# EAGLE schematic EL-100-020-001-maincontrlunit (EAGLE 6.6.0)

## Sheet 1 of 9
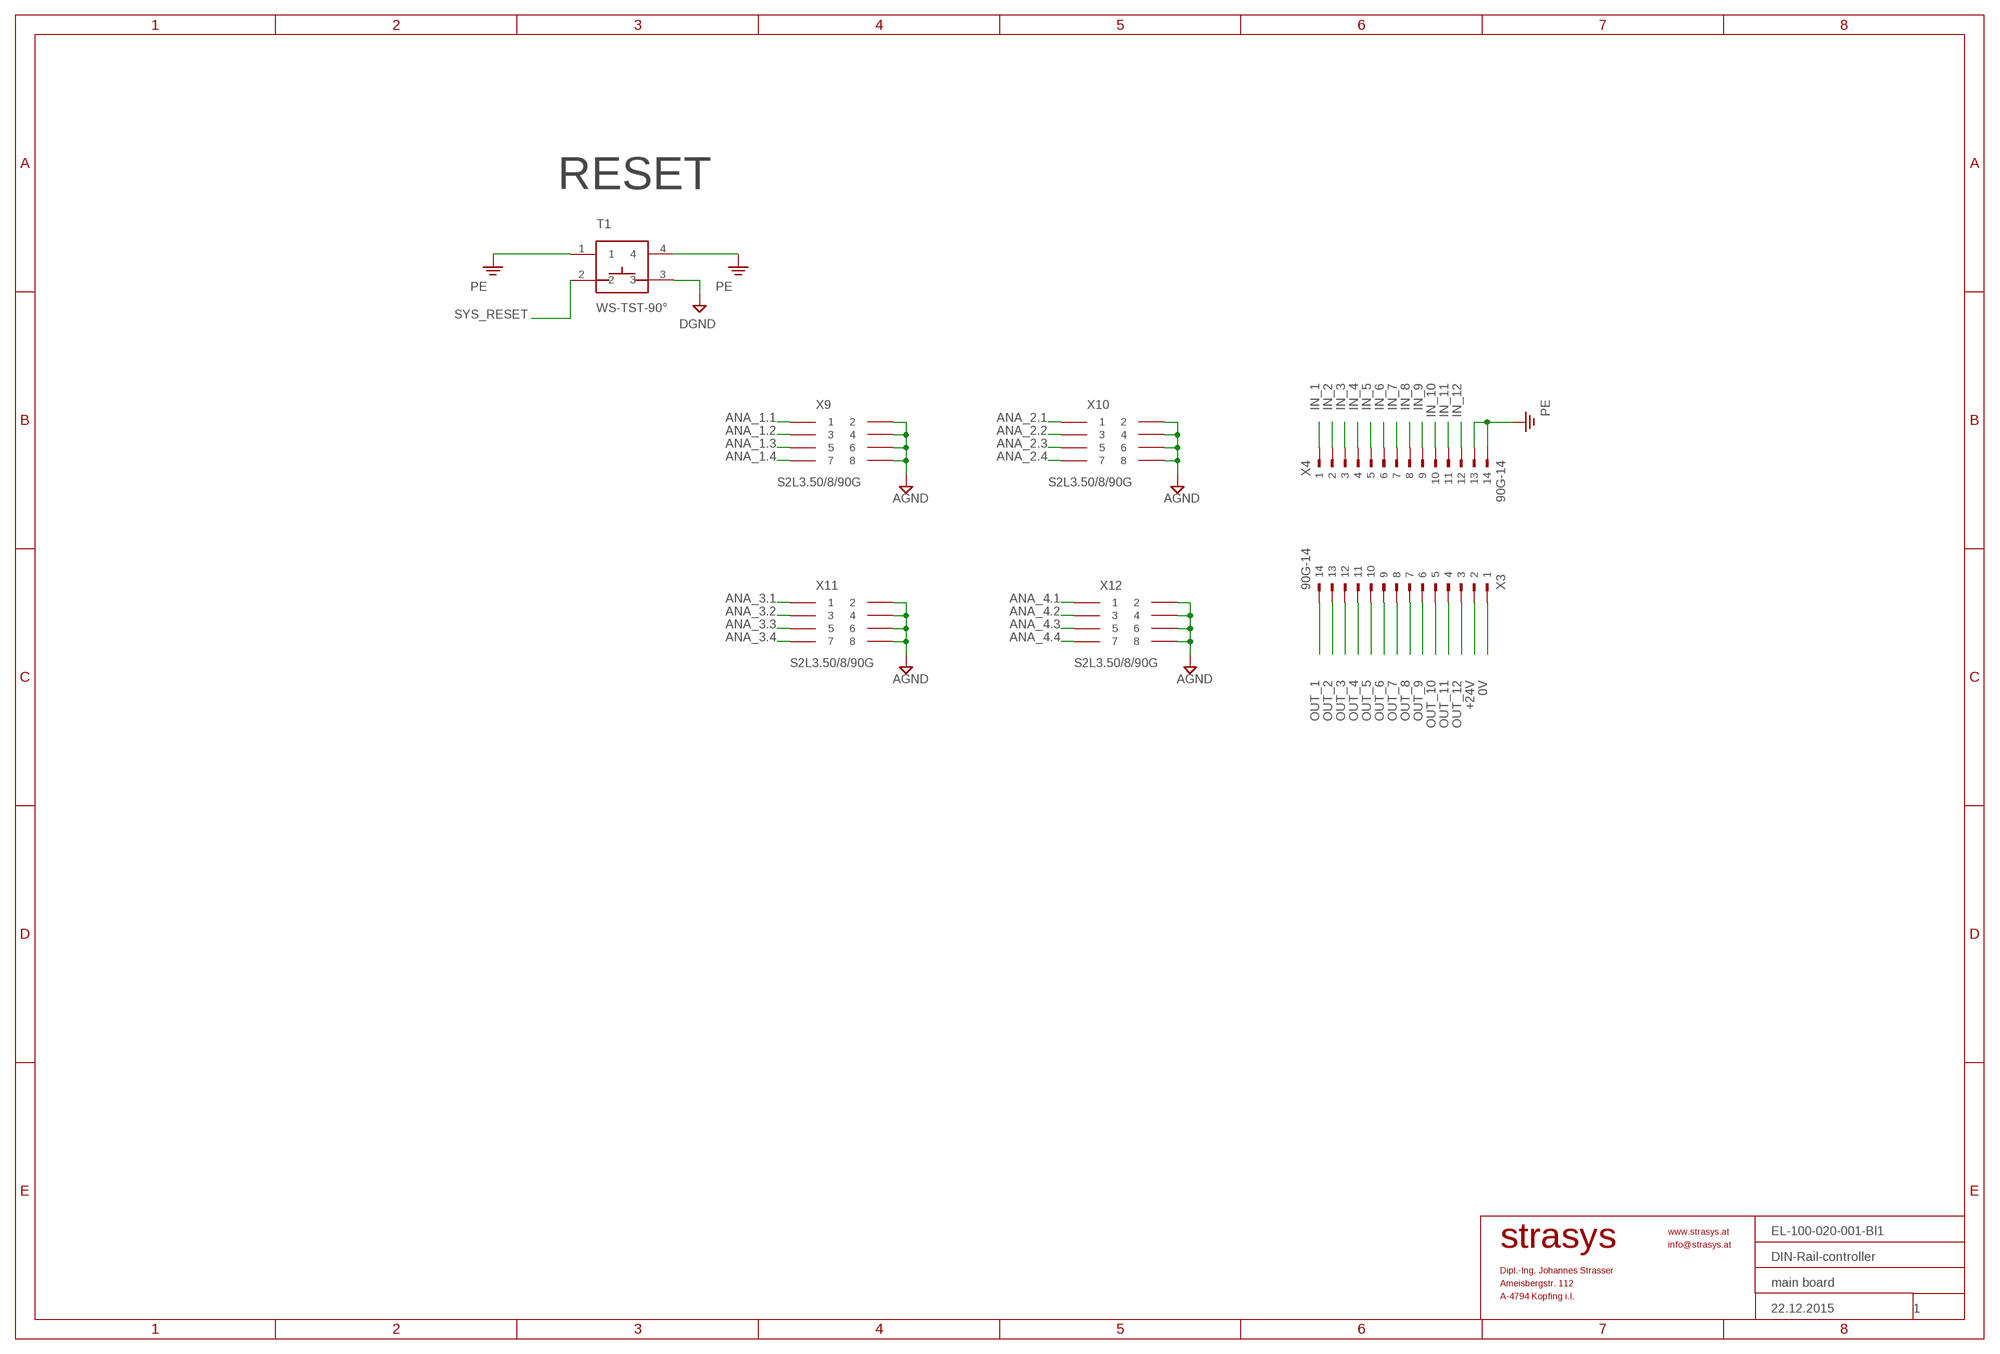
[diagram p0: schematic, sheet 1]
FRAME1 (A3L-LOC): DATE_DRAWING: 22.12.2015; DRAWING_NAME1: DIN-Rail-controller; DRAWING_NAME2: main board; DRAWING_NO: EL-100-020-001-Bl1; PAGE: 1

### Parts
T1  WS-TST-90°  [WS-TST-90°]
X3  90G-14  [90G-14]
X4  90G-14  [90G-14]
X9  S2L3.50/8/90G  [S2L-90G-8]
X10  S2L3.50/8/90G  [S2L-90G-8]
X11  S2L3.50/8/90G  [S2L-90G-8]
X12  S2L3.50/8/90G  [S2L-90G-8]

### Nets
0V: X3.1 ; also sheet 4,5,6,7,9
+24V: X3.2 ; also sheet 4,5,9
AGND: X9.2 X9.4 X9.6 X9.8 X10.2 X10.4 X10.6 X10.8 X11.2 X11.4 X11.6 X11.8 X12.2 X12.4 X12.6 X12.8 ; also sheet 2,8
ANA_1.1: X9.1 ; also sheet 8
ANA_1.2: X9.3 ; also sheet 8
ANA_1.3: X9.5 ; also sheet 8
ANA_1.4: X9.7 ; also sheet 8
ANA_2.1: X10.1 ; also sheet 8
ANA_2.2: X10.3 ; also sheet 8
ANA_2.3: X10.5 ; also sheet 8
ANA_2.4: X10.7 ; also sheet 8
ANA_3.1: X11.1 ; also sheet 8
ANA_3.2: X11.3 ; also sheet 8
ANA_3.3: X11.5 ; also sheet 8
ANA_3.4: X11.7 ; also sheet 8
ANA_4.1: X12.1 ; also sheet 8
ANA_4.2: X12.3 ; also sheet 8
ANA_4.3: X12.5 ; also sheet 8
ANA_4.4: X12.7 ; also sheet 8
DGND: T1.3 ; also sheet 2,3,4,5,6,7,8,9
IN_1: X4.1 ; also sheet 6
IN_2: X4.2 ; also sheet 6
IN_3: X4.3 ; also sheet 6
IN_4: X4.4 ; also sheet 6
IN_5: X4.5 ; also sheet 6
IN_6: X4.6 ; also sheet 6
IN_7: X4.7 ; also sheet 6
IN_8: X4.8 ; also sheet 6
IN_9: X4.9 ; also sheet 7
IN_10: X4.10 ; also sheet 7
IN_11: X4.11 ; also sheet 7
IN_12: X4.12 ; also sheet 7
OUT_1: X3.14 ; also sheet 4
OUT_2: X3.13 ; also sheet 4
OUT_3: X3.12 ; also sheet 4
OUT_4: X3.11 ; also sheet 4
OUT_5: X3.10 ; also sheet 4
OUT_6: X3.9 ; also sheet 4
OUT_7: X3.8 ; also sheet 4
OUT_8: X3.7 ; also sheet 4
OUT_9: X3.6 ; also sheet 5
OUT_10: X3.5 ; also sheet 5
OUT_11: X3.4 ; also sheet 5
OUT_12: X3.3 ; also sheet 5
PE: T1.1 T1.4 X4.13 X4.14 ; also sheet 4,6,7,8
SYS_RESET: T1.2 ; also sheet 2

### Notes on the sheet
- RESET

## Sheet 2 of 9
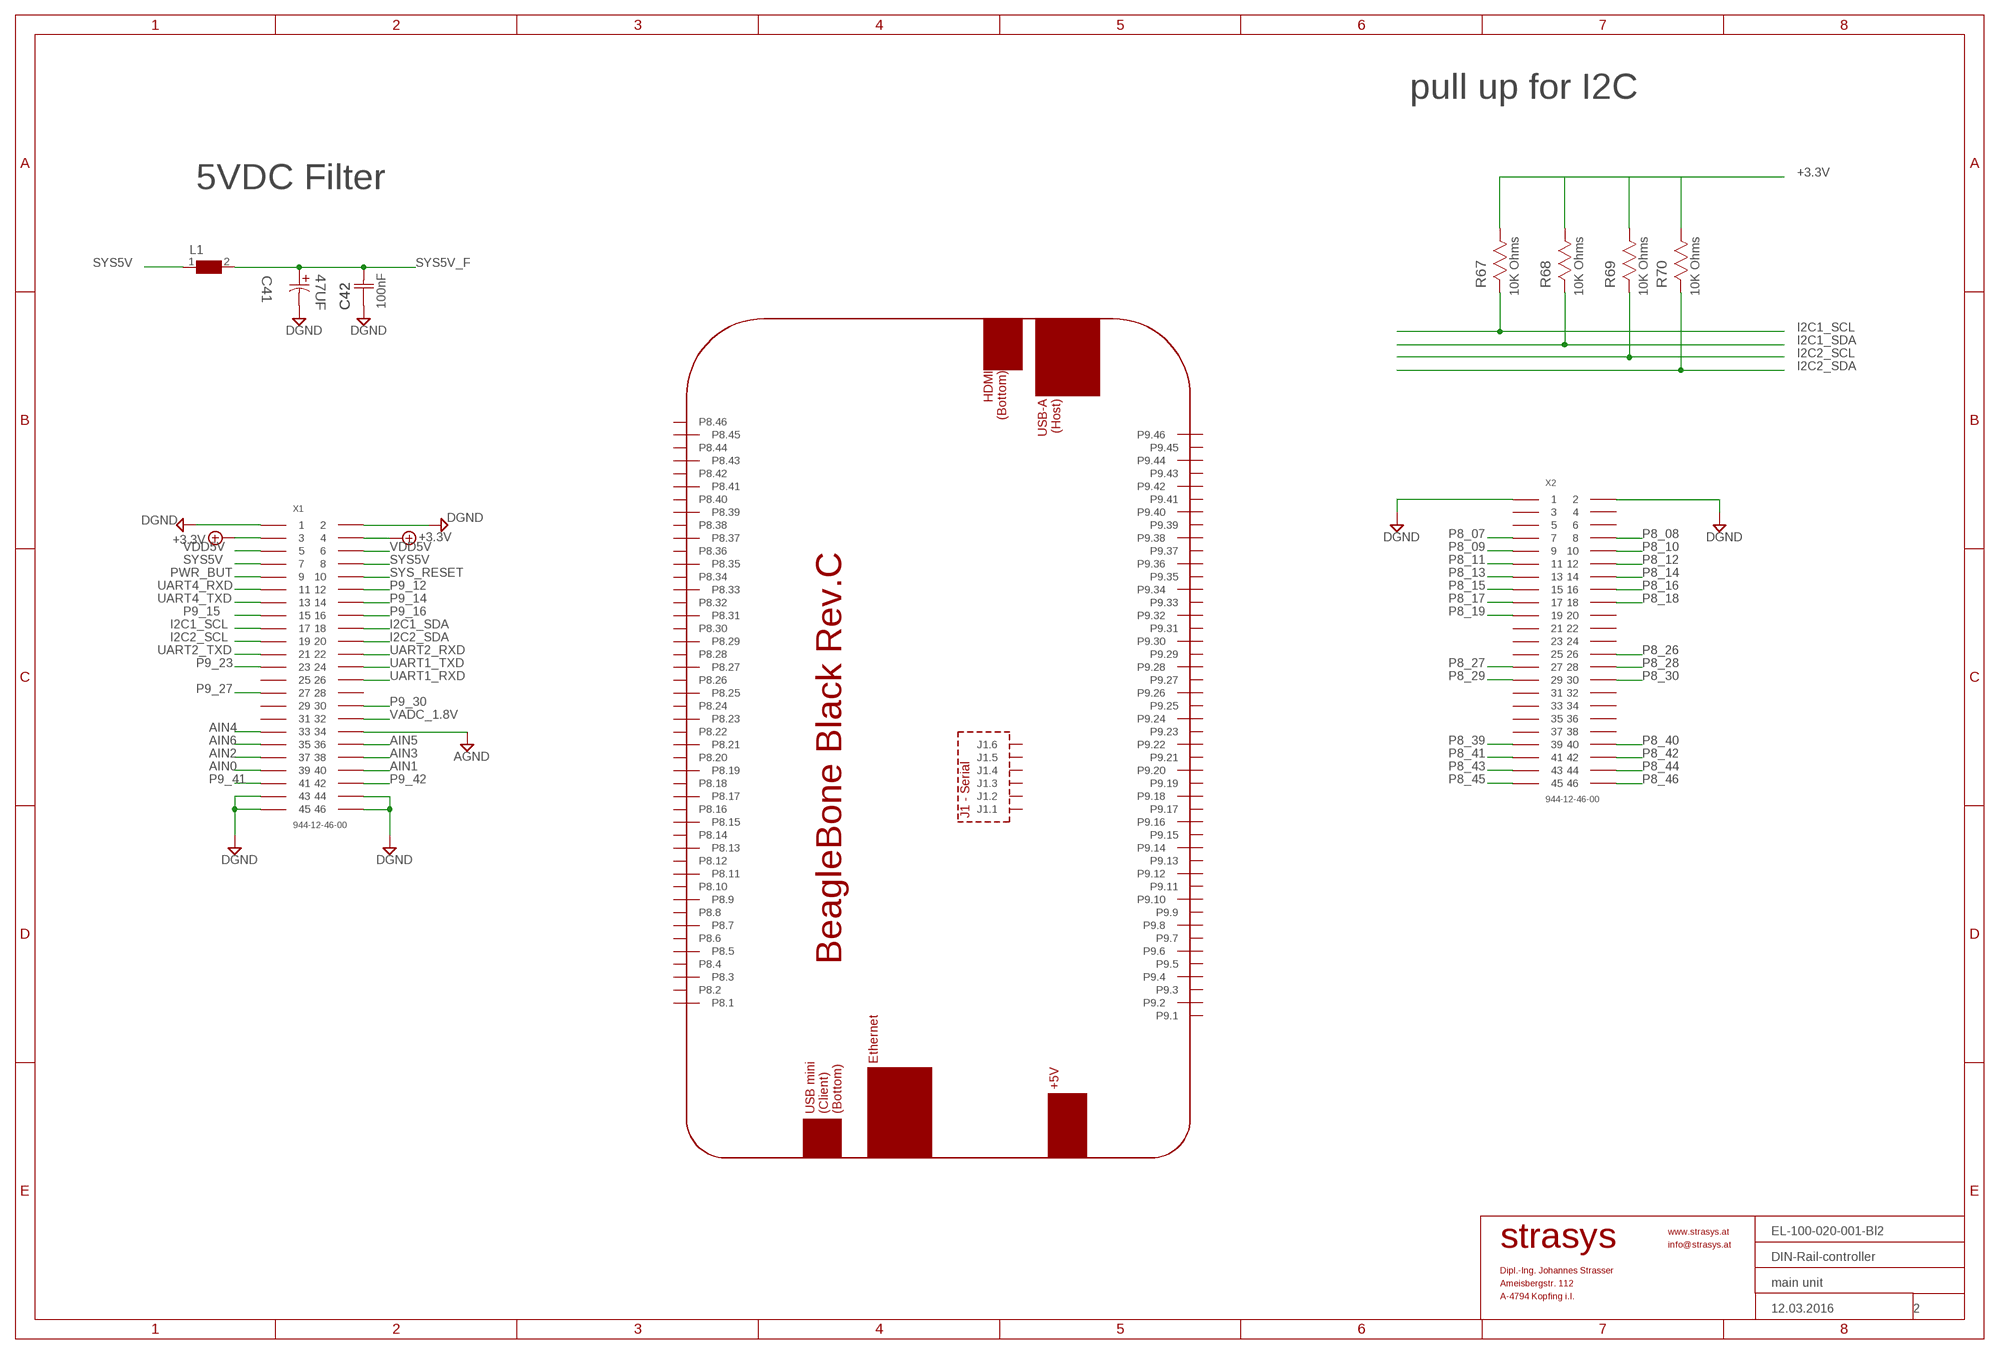
[diagram p1: schematic, sheet 2]
FRAME2 (A3L-LOC): DATE_DRAWING: 12.03.2016; DRAWING_NAME1: DIN-Rail-controller; DRAWING_NAME2: main unit; DRAWING_NO: EL-100-020-001-Bl2; PAGE: 2

### Parts
C41  47UF  EEE-FK1C470P-CASE-D  [CAPAE660X610N]
C42  100nF  C0805C104K5RACTU  [CAPC2013X110N]
L1  WE-CBF-74279218_1206  [1206]
PCB1  BEAGLEBONE_BLACK_EXT  (no package)
R67  10K Ohms  CRCW080510K0JNEA  [RESC2013X65N]
R68  10K Ohms  CRCW080510K0JNEA  [RESC2013X65N]
R69  10K Ohms  CRCW080510K0JNEA  [RESC2013X65N]
R70  10K Ohms  CRCW080510K0JNEA  [RESC2013X65N]
X1  944-12-46-00  [2,54_STIFTLEIST_2X23]
X2  944-12-46-00  [2,54_STIFTLEIST_2X23]

### Nets
+3.3V: R67.1 R68.1 R69.1 R70.1 X1.P3 X1.P4 ; also sheet 3,6,7,8
AGND: X1.P34 ; also sheet 1,8
AIN0: X1.P39 ; also sheet 8
AIN1: X1.P40 ; also sheet 8
AIN2: X1.P37 ; also sheet 8
AIN3: X1.P38 ; also sheet 8
AIN4: X1.P33 ; also sheet 8
AIN5: X1.P36 ; also sheet 8
AIN6: X1.P35 ; also sheet 8
DGND: C41.2 C42.1(C1) X1.P1 X1.P2 X1.P43 X1.P44 X1.P45 X1.P46 X2.P1 X2.P2 ; also sheet 1,3,4,5,6,7,8,9
I2C1_SCL: R67.2 X1.P17 ; also sheet 3,8
I2C1_SDA: R68.2 X1.P18 ; also sheet 3,8
I2C2_SCL: R69.2 X1.P19 ; also sheet 3,8
I2C2_SDA: R70.2 X1.P20 ; also sheet 3,8
P8_07: X2.P7 ; also sheet 4
P8_08: X2.P8 ; also sheet 4
P8_09: X2.P9 ; also sheet 4
P8_10: X2.P10 ; also sheet 4
P8_11: X2.P11 ; also sheet 4
P8_12: X2.P12 ; also sheet 4
P8_13: X2.P13 ; also sheet 4
P8_14: X2.P14 ; also sheet 4
P8_15: X2.P15 ; also sheet 6
P8_16: X2.P16 ; also sheet 6
P8_17: X2.P17 ; also sheet 6
P8_18: X2.P18 ; also sheet 6
P8_19: X2.P19
P8_26: X2.P26
P8_27: X2.P27 ; also sheet 5
P8_28: X2.P28 ; also sheet 5
P8_29: X2.P29 ; also sheet 5
P8_30: X2.P30 ; also sheet 5
P8_39: X2.P39 ; also sheet 6
P8_40: X2.P40 ; also sheet 6
P8_41: X2.P41 ; also sheet 6
P8_42: X2.P42 ; also sheet 6
P8_43: X2.P43 ; also sheet 7
P8_44: X2.P44 ; also sheet 7
P8_45: X2.P45 ; also sheet 7
P8_46: X2.P46 ; also sheet 7
P9_12: X1.P12
P9_14: X1.P14 ; also sheet 9
P9_15: X1.P15 ; also sheet 9
P9_16: X1.P16
P9_23: X1.P23
P9_27: X1.P27
P9_30: X1.P30
P9_41: X1.P41
P9_42: X1.P42
PWR_BUT: X1.P9
SYS5V: L1.1 X1.P7 X1.P8
SYS5V_F: C41.1 C42.2(C2) L1.2 ; also sheet 8,9
SYS_RESET: X1.P10 ; also sheet 1
UART1_RXD: X1.P26
UART1_TXD: X1.P24
UART2_RXD: X1.P22
UART2_TXD: X1.P21
UART4_RXD: X1.P11
UART4_TXD: X1.P13
VADC_1.8V: X1.P32
VDD5V: X1.P5 X1.P6
Unconnected: PCB1.J1.1 PCB1.J1.2 PCB1.J1.3 PCB1.J1.4 PCB1.J1.5 PCB1.J1.6 PCB1.P8.1 PCB1.P8.2 PCB1.P8.3 PCB1.P8.4 PCB1.P8.5 PCB1.P8.6 PCB1.P8.7 PCB1.P8.8 PCB1.P8.9 PCB1.P8.10 PCB1.P8.11 PCB1.P8.12 PCB1.P8.13 PCB1.P8.14 PCB1.P8.15 PCB1.P8.16 PCB1.P8.17 PCB1.P8.18 PCB1.P8.19 PCB1.P8.20 PCB1.P8.21 PCB1.P8.22 PCB1.P8.23 PCB1.P8.24 PCB1.P8.25 PCB1.P8.26 PCB1.P8.27 PCB1.P8.28 PCB1.P8.29 PCB1.P8.30 PCB1.P8.31 PCB1.P8.32 PCB1.P8.33 PCB1.P8.34 PCB1.P8.35 PCB1.P8.36 PCB1.P8.37 PCB1.P8.38 PCB1.P8.39 PCB1.P8.40 PCB1.P8.41 PCB1.P8.42 PCB1.P8.43 PCB1.P8.44 PCB1.P8.45 PCB1.P8.46 PCB1.P9.1 PCB1.P9.2 PCB1.P9.3 PCB1.P9.4 PCB1.P9.5 PCB1.P9.6 PCB1.P9.7 PCB1.P9.8 PCB1.P9.9 PCB1.P9.10 PCB1.P9.11 PCB1.P9.12 PCB1.P9.13 PCB1.P9.14 PCB1.P9.15 PCB1.P9.16 PCB1.P9.17 PCB1.P9.18 PCB1.P9.19 PCB1.P9.20 PCB1.P9.21 PCB1.P9.22 PCB1.P9.23 PCB1.P9.24 PCB1.P9.25 PCB1.P9.26 PCB1.P9.27 PCB1.P9.28 PCB1.P9.29 PCB1.P9.30 PCB1.P9.31 PCB1.P9.32 PCB1.P9.33 PCB1.P9.34 PCB1.P9.35 PCB1.P9.36 PCB1.P9.37 PCB1.P9.38 PCB1.P9.39 PCB1.P9.40 PCB1.P9.41 PCB1.P9.42 PCB1.P9.43 PCB1.P9.44 PCB1.P9.45 PCB1.P9.46 X1.P25 X1.P28 X1.P29 X1.P31 X2.P3 X2.P4 X2.P5 X2.P6 X2.P20 X2.P21 X2.P22 X2.P23 X2.P24 X2.P25 X2.P31 X2.P32 X2.P33 X2.P34 X2.P35 X2.P36 X2.P37 X2.P38

### Notes on the sheet
- pull up for I2C
- 5VDC Filter

## Sheet 3 of 9
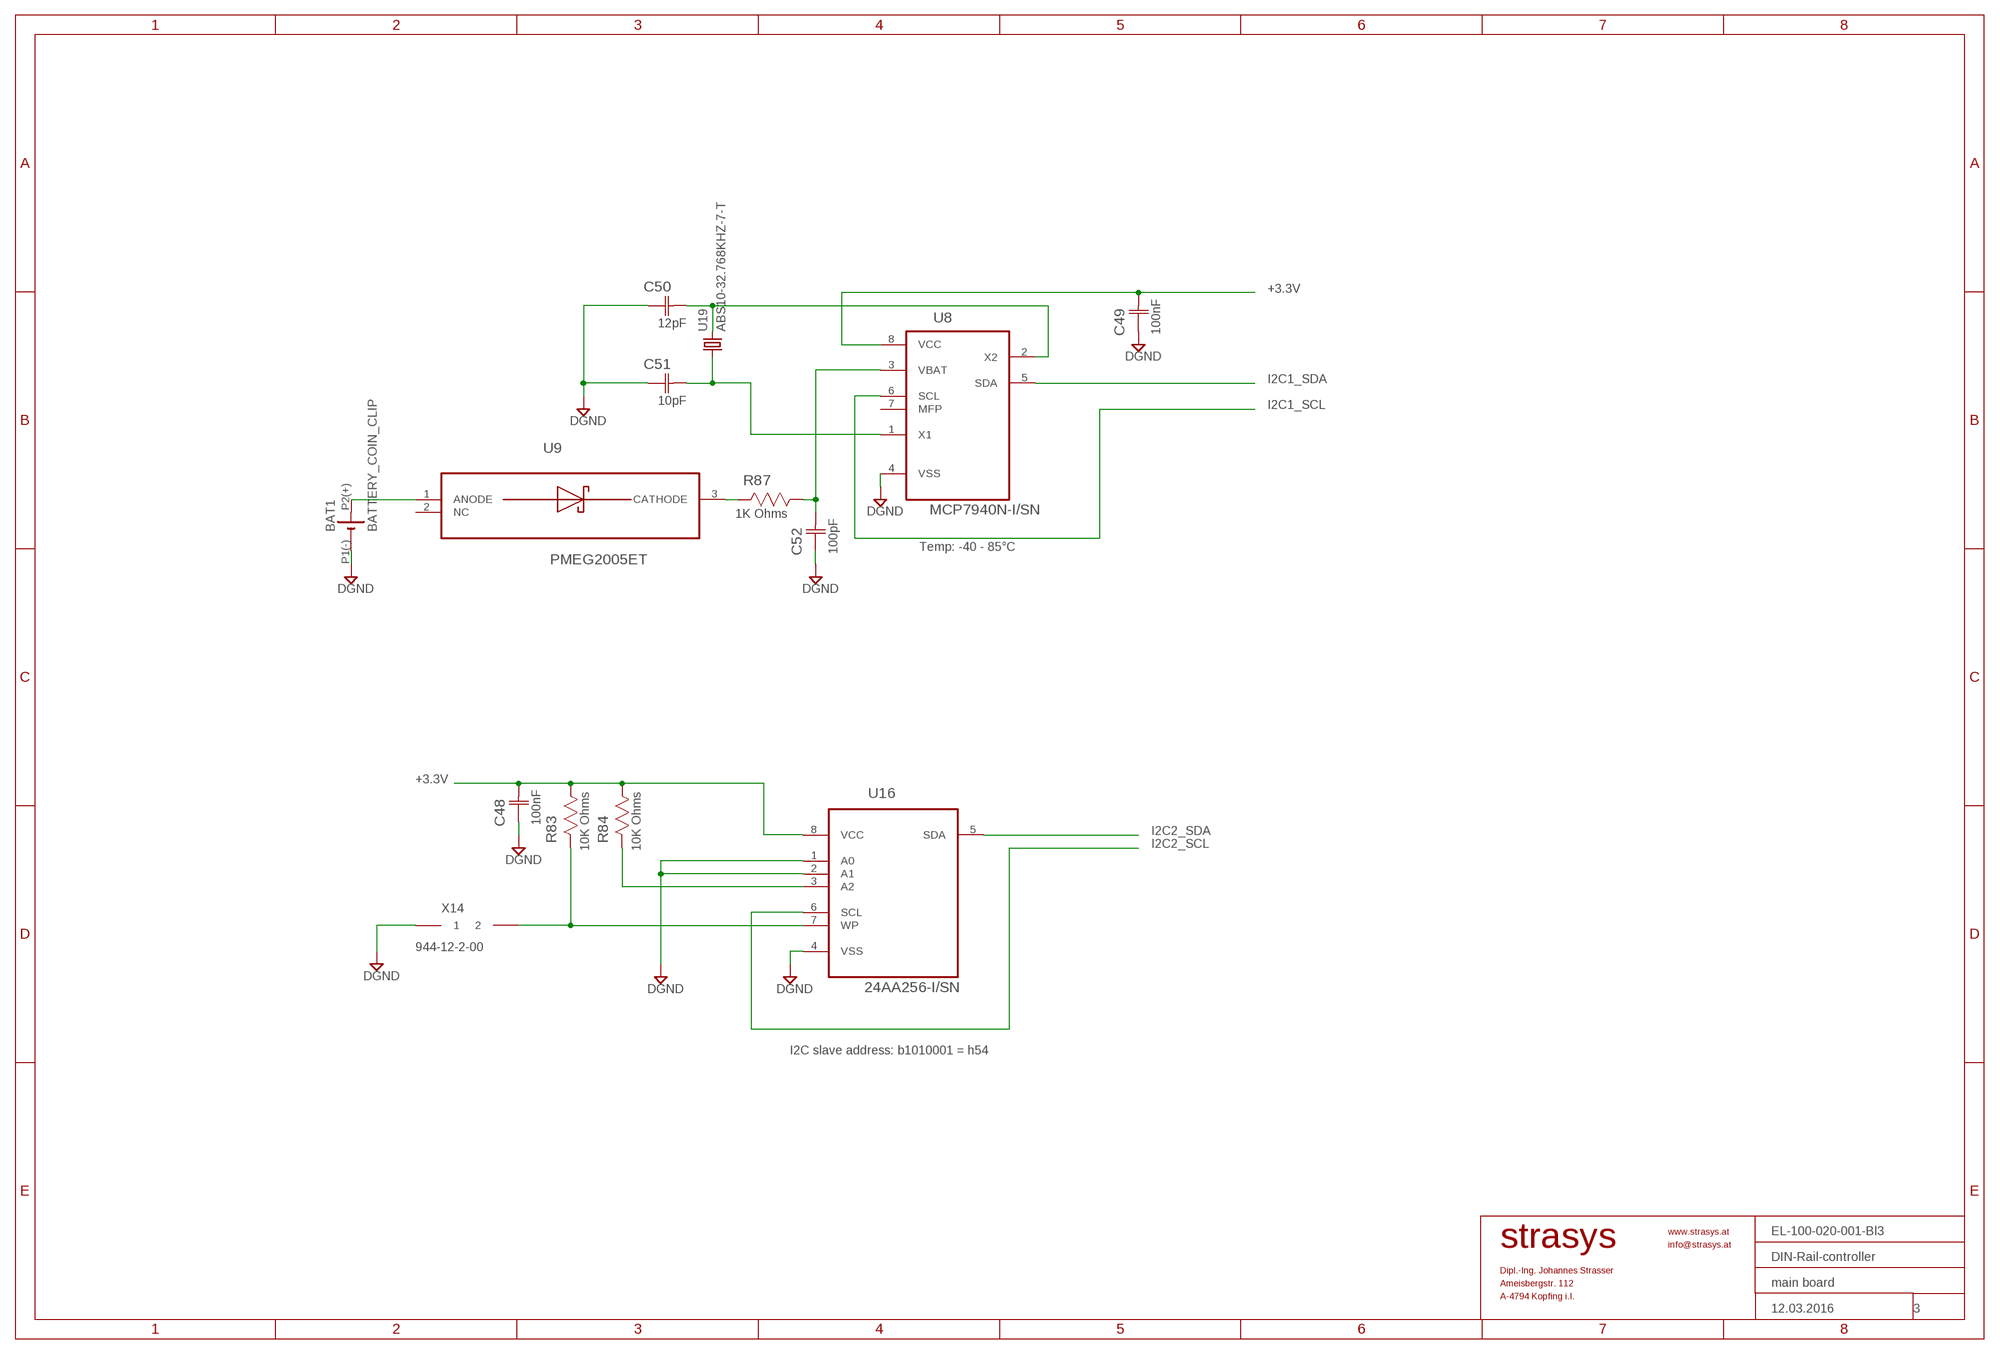
[diagram p2: schematic, sheet 3]
FRAME3 (A3L-LOC): DATE_DRAWING: 12.03.2016; DRAWING_NAME1: DIN-Rail-controller; DRAWING_NAME2: main board; DRAWING_NO: EL-100-020-001-Bl3; PAGE: 3

### Parts
BAT1  BATTERY_COIN_CLIP  [BAT_HOLDER_16MM]
C48  100nF  C0805C104K5RACTU  [CAPC2013X110N]
C49  100nF  C0805C104K5RACTU  [CAPC2013X110N]
C50  12pF  C0805C120J5GACTU  [CAPC2013X88N]
C51  10pF  C0805C100J5GACTU  [CAPC2013X88N]
C52  100pF  C0805C101J5GACTU  [CAPC2013X88N]
R83  10K Ohms  CRCW080510K0JNEA  [RESC2013X65N]
R84  10K Ohms  CRCW080510K0JNEA  [RESC2013X65N]
R87  1K Ohms  CRCW08051K00FKEA  [RESC2013X65N]
U8  MCP7940N-I/SN  [SOIC127P600X175-8N]
U9  PMEG2005ET  [SOT95P280X145-5N]
U16  24AA256-I/SN  [SOIC127P600X175-8N]
U19  ABS10-32.768KHZ-7-T  [ABS-10]
X14  944-12-2-00  [2,54_2X1]

### Nets
24AA_WP: R83.2 U16.7(WP) X14.P2
+3.3V: C48.2(C2) C49.2(C2) R83.1 R84.1 U8.8(VCC) U16.8(VCC) ; also sheet 2,6,7,8
BAT-SUPPLY: BAT1.P2(+)(+) U9.1(ANODE)
DGND: BAT1.P1(-)(-) C48.1(C1) C49.1(C1) C50.1(C1) C51.1(C1) C52.1(C1) U8.4(VSS) U16.1(A0) U16.2(A1) U16.4(VSS) X14.P1 ; also sheet 1,2,4,5,6,7,8,9
I2C1_SCL: U8.6(SCL) ; also sheet 2,8
I2C1_SDA: U8.5(SDA) ; also sheet 2,8
I2C2_SCL: U16.6(SCL) ; also sheet 2,8
I2C2_SDA: U16.5(SDA) ; also sheet 2,8
N$5: R84.2 U16.3(A2)
N$46: R87.2 U9.3(CATHODE)
N$47: C52.2(C2) R87.1 U8.3(VBAT)
N$48: C50.2(C2) U8.2(X2) U19.P$2
N$51: C51.2(C2) U8.1(X1) U19.P$1
Unconnected: U8.7(MFP) U9.2(NC)

### Notes on the sheet
- Temp: -40 - 85°C
- I2C slave address: b1010001 = h54

## Sheet 4 of 9
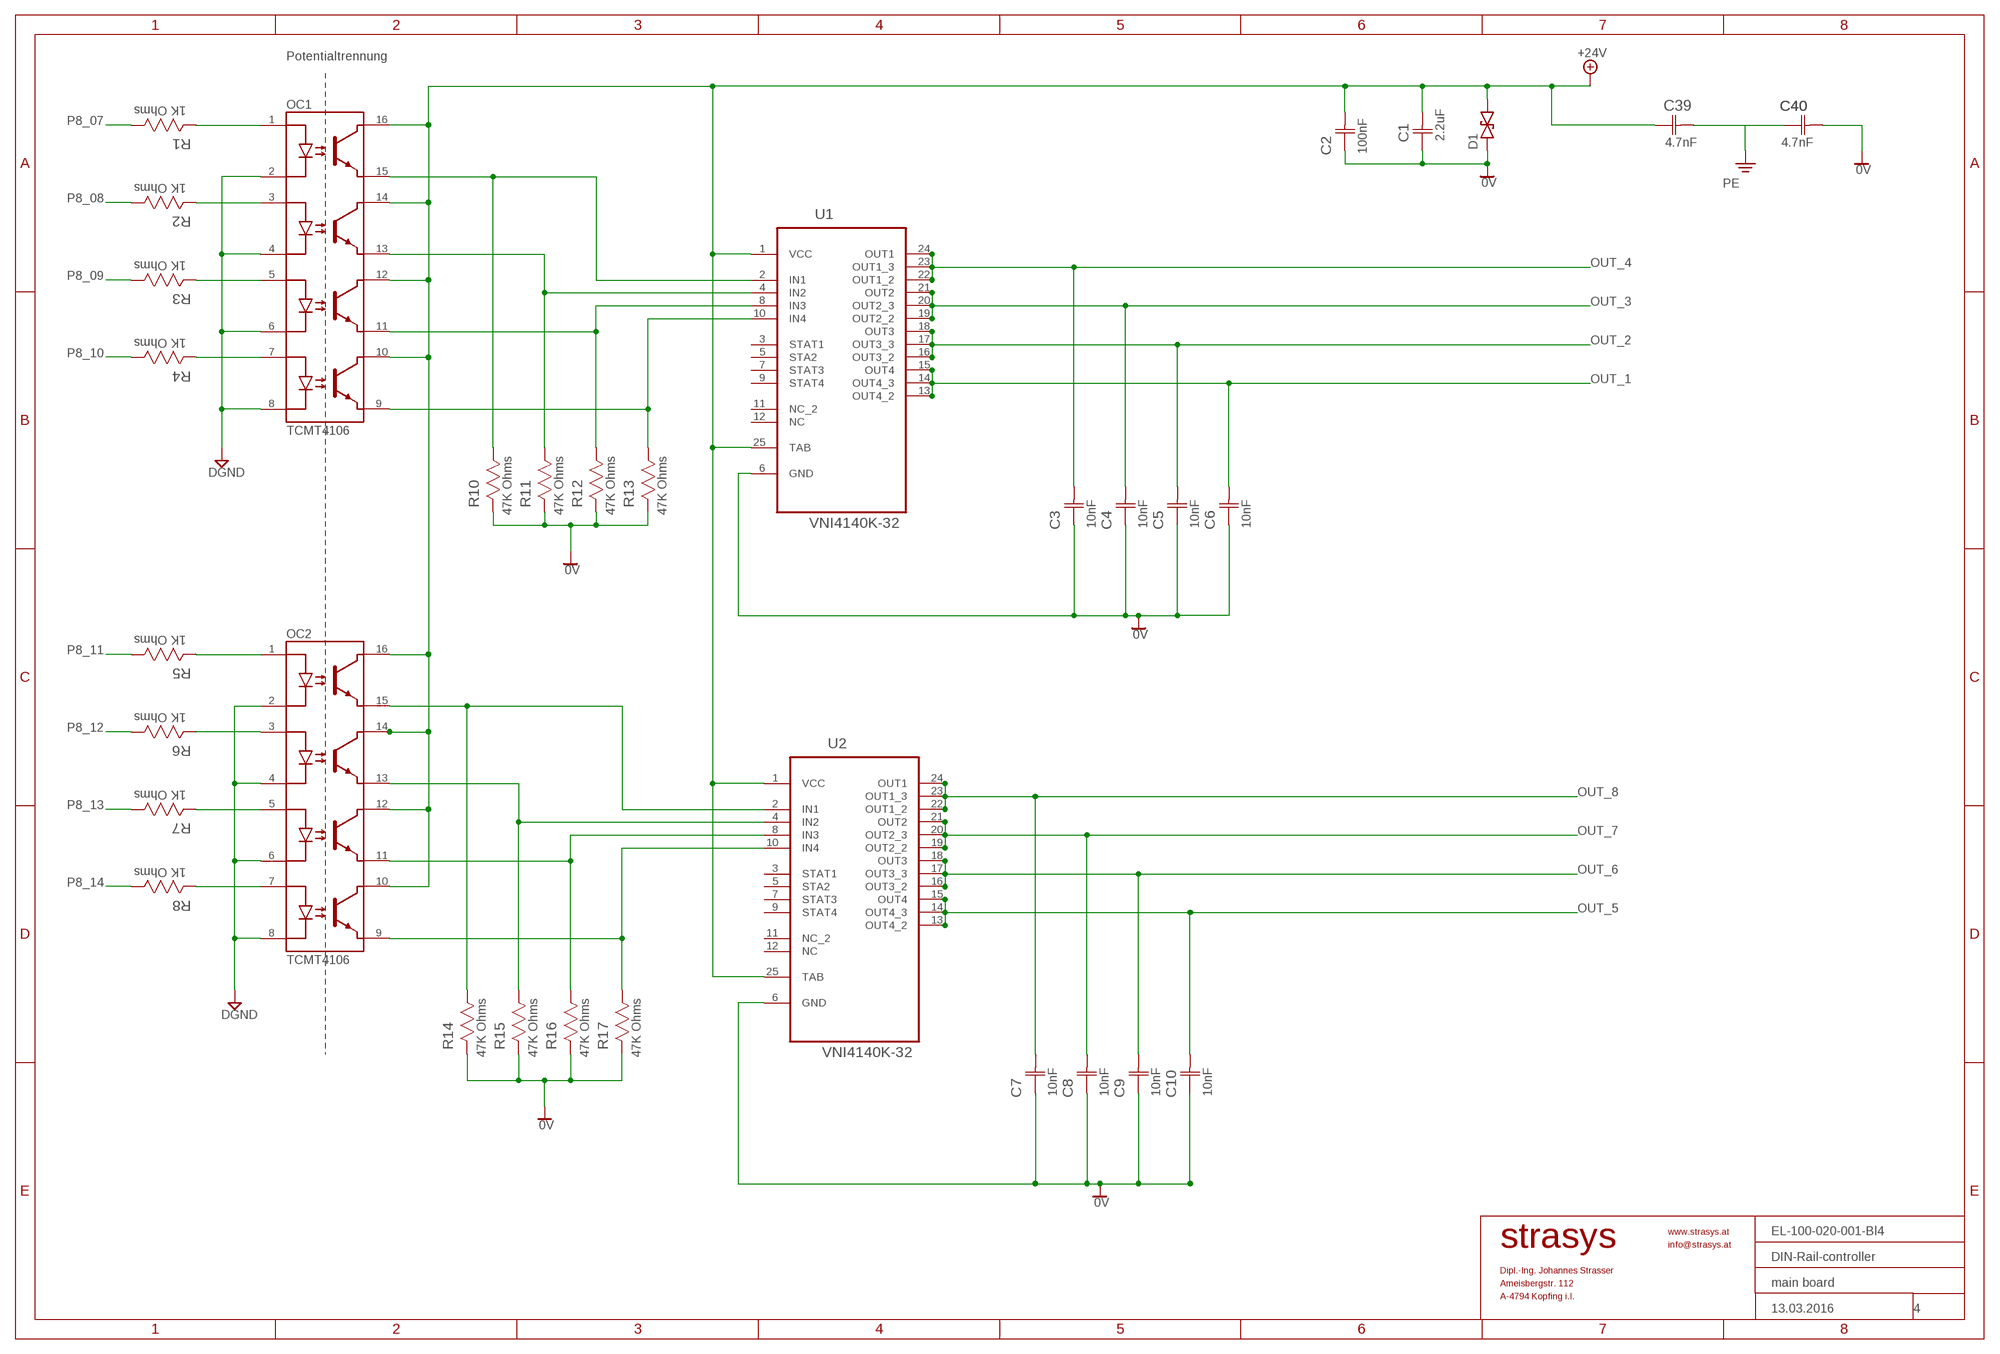
[diagram p3: schematic, sheet 4]
FRAME4 (A3L-LOC): DATE_DRAWING: 13.03.2016; DRAWING_NAME1: DIN-Rail-controller; DRAWING_NAME2: main board; DRAWING_NO: EL-100-020-001-Bl4; PAGE: 4

### Parts
C1  2.2uF  C1206C225K5RACTU  [CAPC3216X180N]
C2  100nF  C0805C104K5RACTU  [CAPC2013X110N]
C3  10nF  C0805C103K1RACTU  [CAPC2013X88N]
C4  10nF  C0805C103K1RACTU  [CAPC2013X88N]
C5  10nF  C0805C103K1RACTU  [CAPC2013X88N]
C6  10nF  C0805C103K1RACTU  [CAPC2013X88N]
C7  10nF  C0805C103K1RACTU  [CAPC2013X88N]
C8  10nF  C0805C103K1RACTU  [CAPC2013X88N]
C9  10nF  C0805C103K1RACTU  [CAPC2013X88N]
C10  10nF  C0805C103K1RACTU  [CAPC2013X88N]
C39  4.7nF  C0805F472K1RACAUTO  [CAPC2013X88N]
C40  4.7nF  C0805F472K1RACAUTO  [CAPC2013X88N]
D1  SMA6J33CA  [DO-214AC]
OC1  TCMT4106  [SOP-16]
OC2  TCMT4106  [SOP-16]
R1  1K Ohms  CRCW08051K00JNEA  [RESC2013X65N]
R2  1K Ohms  CRCW08051K00JNEA  [RESC2013X65N]
R3  1K Ohms  CRCW08051K00JNEA  [RESC2013X65N]
R4  1K Ohms  CRCW08051K00JNEA  [RESC2013X65N]
R5  1K Ohms  CRCW08051K00JNEA  [RESC2013X65N]
R6  1K Ohms  CRCW08051K00JNEA  [RESC2013X65N]
R7  1K Ohms  CRCW08051K00JNEA  [RESC2013X65N]
R8  1K Ohms  CRCW08051K00JNEA  [RESC2013X65N]
R10  47K Ohms  CRCW080547K0JNEA  [RESC2013X65N]
R11  47K Ohms  CRCW080547K0JNEA  [RESC2013X65N]
R12  47K Ohms  CRCW080547K0JNEA  [RESC2013X65N]
R13  47K Ohms  CRCW080547K0JNEA  [RESC2013X65N]
R14  47K Ohms  CRCW080547K0JNEA  [RESC2013X65N]
R15  47K Ohms  CRCW080547K0JNEA  [RESC2013X65N]
R16  47K Ohms  CRCW080547K0JNEA  [RESC2013X65N]
R17  47K Ohms  CRCW080547K0JNEA  [RESC2013X65N]
U1  VNI4140K-32  [SOP80P1030X247-25N]
U2  VNI4140K-32  [SOP80P1030X247-25N]

### Nets
0V: C1.1(C1) C2.1(C1) C3.1(C1) C4.1(C1) C5.1(C1) C6.1(C1) C7.1(C1) C8.1(C1) C9.1(C1) C10.1(C1) C40.2(C2) D1.1 R10.2 R11.2 R12.2 R13.2 R14.2 R15.2 R16.2 R17.2 U1.6(GND) U2.6(GND) ; also sheet 1,5,6,7,9
+24V: C1.2(C2) C2.2(C2) C39.1(C1) D1.2 OC1.10 OC1.12 OC1.14 OC1.16 OC2.10 OC2.12 OC2.14 OC2.16 U1.1(VCC) U1.25(TAB) U2.1(VCC) U2.25(TAB) ; also sheet 1,5,9
DGND: OC1.2 OC1.4 OC1.6 OC1.8 OC2.2 OC2.4 OC2.6 OC2.8 ; also sheet 1,2,3,5,6,7,8,9
N$6: OC1.5 R3.2
N$7: OC1.7 R4.2
N$8: OC2.3 R6.2
N$9: OC2.5 R7.2
N$10: OC2.7 R8.2
N$14: OC1.1 R1.2
N$15: OC1.3 R2.2
N$19: OC1.15 R10.1 U1.2(IN1)
N$20: OC1.13 R11.1 U1.4(IN2)
N$21: OC1.11 R12.1 U1.8(IN3)
N$22: OC1.9 R13.1 U1.10(IN4)
N$23: OC2.1 R5.2
N$27: OC2.15 R14.1 U2.2(IN1)
N$28: OC2.13 R15.1 U2.4(IN2)
N$29: OC2.11 R16.1 U2.8(IN3)
N$30: OC2.9 R17.1 U2.10(IN4)
OUT_1: C6.2(C2) U1.13(OUT4_2) U1.14(OUT4_3) U1.15(OUT4) ; also sheet 1
OUT_2: C5.2(C2) U1.16(OUT3_2) U1.17(OUT3_3) U1.18(OUT3) ; also sheet 1
OUT_3: C4.2(C2) U1.19(OUT2_2) U1.20(OUT2_3) U1.21(OUT2) ; also sheet 1
OUT_4: C3.2(C2) U1.22(OUT1_2) U1.23(OUT1_3) U1.24(OUT1) ; also sheet 1
OUT_5: C10.2(C2) U2.13(OUT4_2) U2.14(OUT4_3) U2.15(OUT4) ; also sheet 1
OUT_6: C9.2(C2) U2.16(OUT3_2) U2.17(OUT3_3) U2.18(OUT3) ; also sheet 1
OUT_7: C8.2(C2) U2.19(OUT2_2) U2.20(OUT2_3) U2.21(OUT2) ; also sheet 1
OUT_8: C7.2(C2) U2.22(OUT1_2) U2.23(OUT1_3) U2.24(OUT1) ; also sheet 1
P8_07: R1.1 ; also sheet 2
P8_08: R2.1 ; also sheet 2
P8_09: R3.1 ; also sheet 2
P8_10: R4.1 ; also sheet 2
P8_11: R5.1 ; also sheet 2
P8_12: R6.1 ; also sheet 2
P8_13: R7.1 ; also sheet 2
P8_14: R8.1 ; also sheet 2
PE: C39.2(C2) C40.1(C1) ; also sheet 1,6,7,8
Unconnected: U1.3(STAT1) U1.5(STA2) U1.7(STAT3) U1.9(STAT4) U1.11(NC_2) U1.12(NC) U2.3(STAT1) U2.5(STA2) U2.7(STAT3) U2.9(STAT4) U2.11(NC_2) U2.12(NC)

### Notes on the sheet
- Potentialtrennung

## Sheet 5 of 9
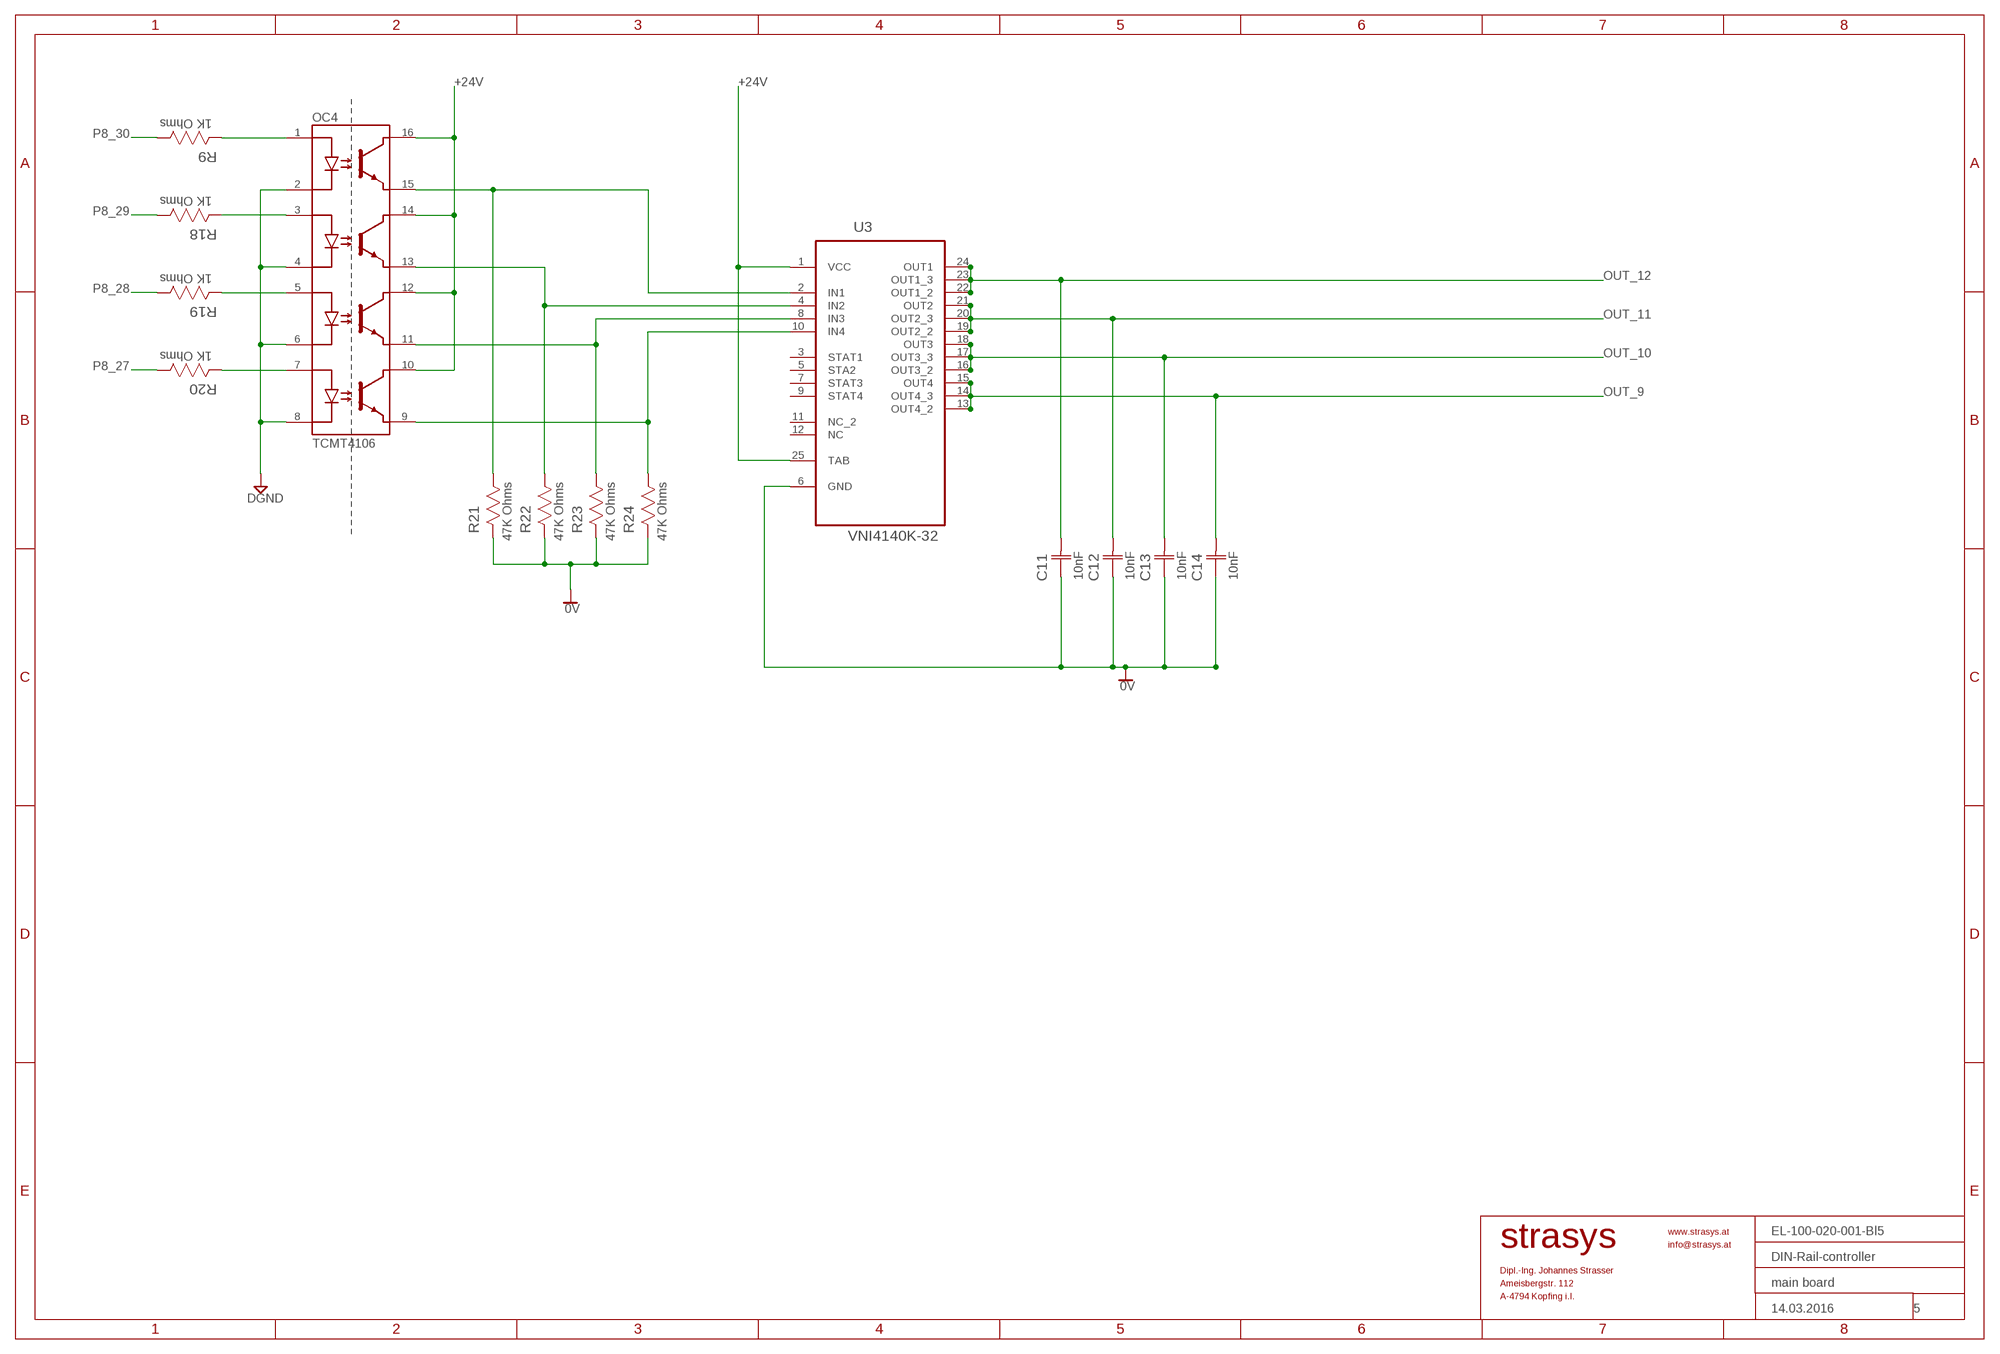
[diagram p4: schematic, sheet 5]
FRAME5 (A3L-LOC): DATE_DRAWING: 14.03.2016; DRAWING_NAME1: DIN-Rail-controller; DRAWING_NAME2: main board; DRAWING_NO: EL-100-020-001-Bl5; PAGE: 5

### Parts
C11  10nF  C0805C103K1RACTU  [CAPC2013X88N]
C12  10nF  C0805C103K1RACTU  [CAPC2013X88N]
C13  10nF  C0805C103K1RACTU  [CAPC2013X88N]
C14  10nF  C0805C103K1RACTU  [CAPC2013X88N]
OC4  TCMT4106  [SOP-16]
R9  1K Ohms  CRCW08051K00JNEA  [RESC2013X65N]
R18  1K Ohms  CRCW08051K00JNEA  [RESC2013X65N]
R19  1K Ohms  CRCW08051K00JNEA  [RESC2013X65N]
R20  1K Ohms  CRCW08051K00JNEA  [RESC2013X65N]
R21  47K Ohms  CRCW080547K0JNEA  [RESC2013X65N]
R22  47K Ohms  CRCW080547K0JNEA  [RESC2013X65N]
R23  47K Ohms  CRCW080547K0JNEA  [RESC2013X65N]
R24  47K Ohms  CRCW080547K0JNEA  [RESC2013X65N]
U3  VNI4140K-32  [SOP80P1030X247-25N]

### Nets
0V: C11.1(C1) C12.1(C1) C13.1(C1) C14.1(C1) R21.2 R22.2 R23.2 R24.2 U3.6(GND) ; also sheet 1,4,6,7,9
+24V: OC4.10 OC4.12 OC4.14 OC4.16 U3.1(VCC) U3.25(TAB) ; also sheet 1,4,9
DGND: OC4.2 OC4.4 OC4.6 OC4.8 ; also sheet 1,2,3,4,6,7,8,9
N$11: OC4.1 R9.2
N$12: OC4.15 R21.1 U3.2(IN1)
N$13: OC4.13 R22.1 U3.4(IN2)
N$16: OC4.11 R23.1 U3.8(IN3)
N$17: OC4.9 R24.1 U3.10(IN4)
N$18: OC4.3 R18.2
N$24: OC4.5 R19.2
N$25: OC4.7 R20.2
OUT_9: C14.2(C2) U3.13(OUT4_2) U3.14(OUT4_3) U3.15(OUT4) ; also sheet 1
OUT_10: C13.2(C2) U3.16(OUT3_2) U3.17(OUT3_3) U3.18(OUT3) ; also sheet 1
OUT_11: C12.2(C2) U3.19(OUT2_2) U3.20(OUT2_3) U3.21(OUT2) ; also sheet 1
OUT_12: C11.2(C2) U3.22(OUT1_2) U3.23(OUT1_3) U3.24(OUT1) ; also sheet 1
P8_27: R20.1 ; also sheet 2
P8_28: R19.1 ; also sheet 2
P8_29: R18.1 ; also sheet 2
P8_30: R9.1 ; also sheet 2
Unconnected: U3.3(STAT1) U3.5(STA2) U3.7(STAT3) U3.9(STAT4) U3.11(NC_2) U3.12(NC)

## Sheet 6 of 9
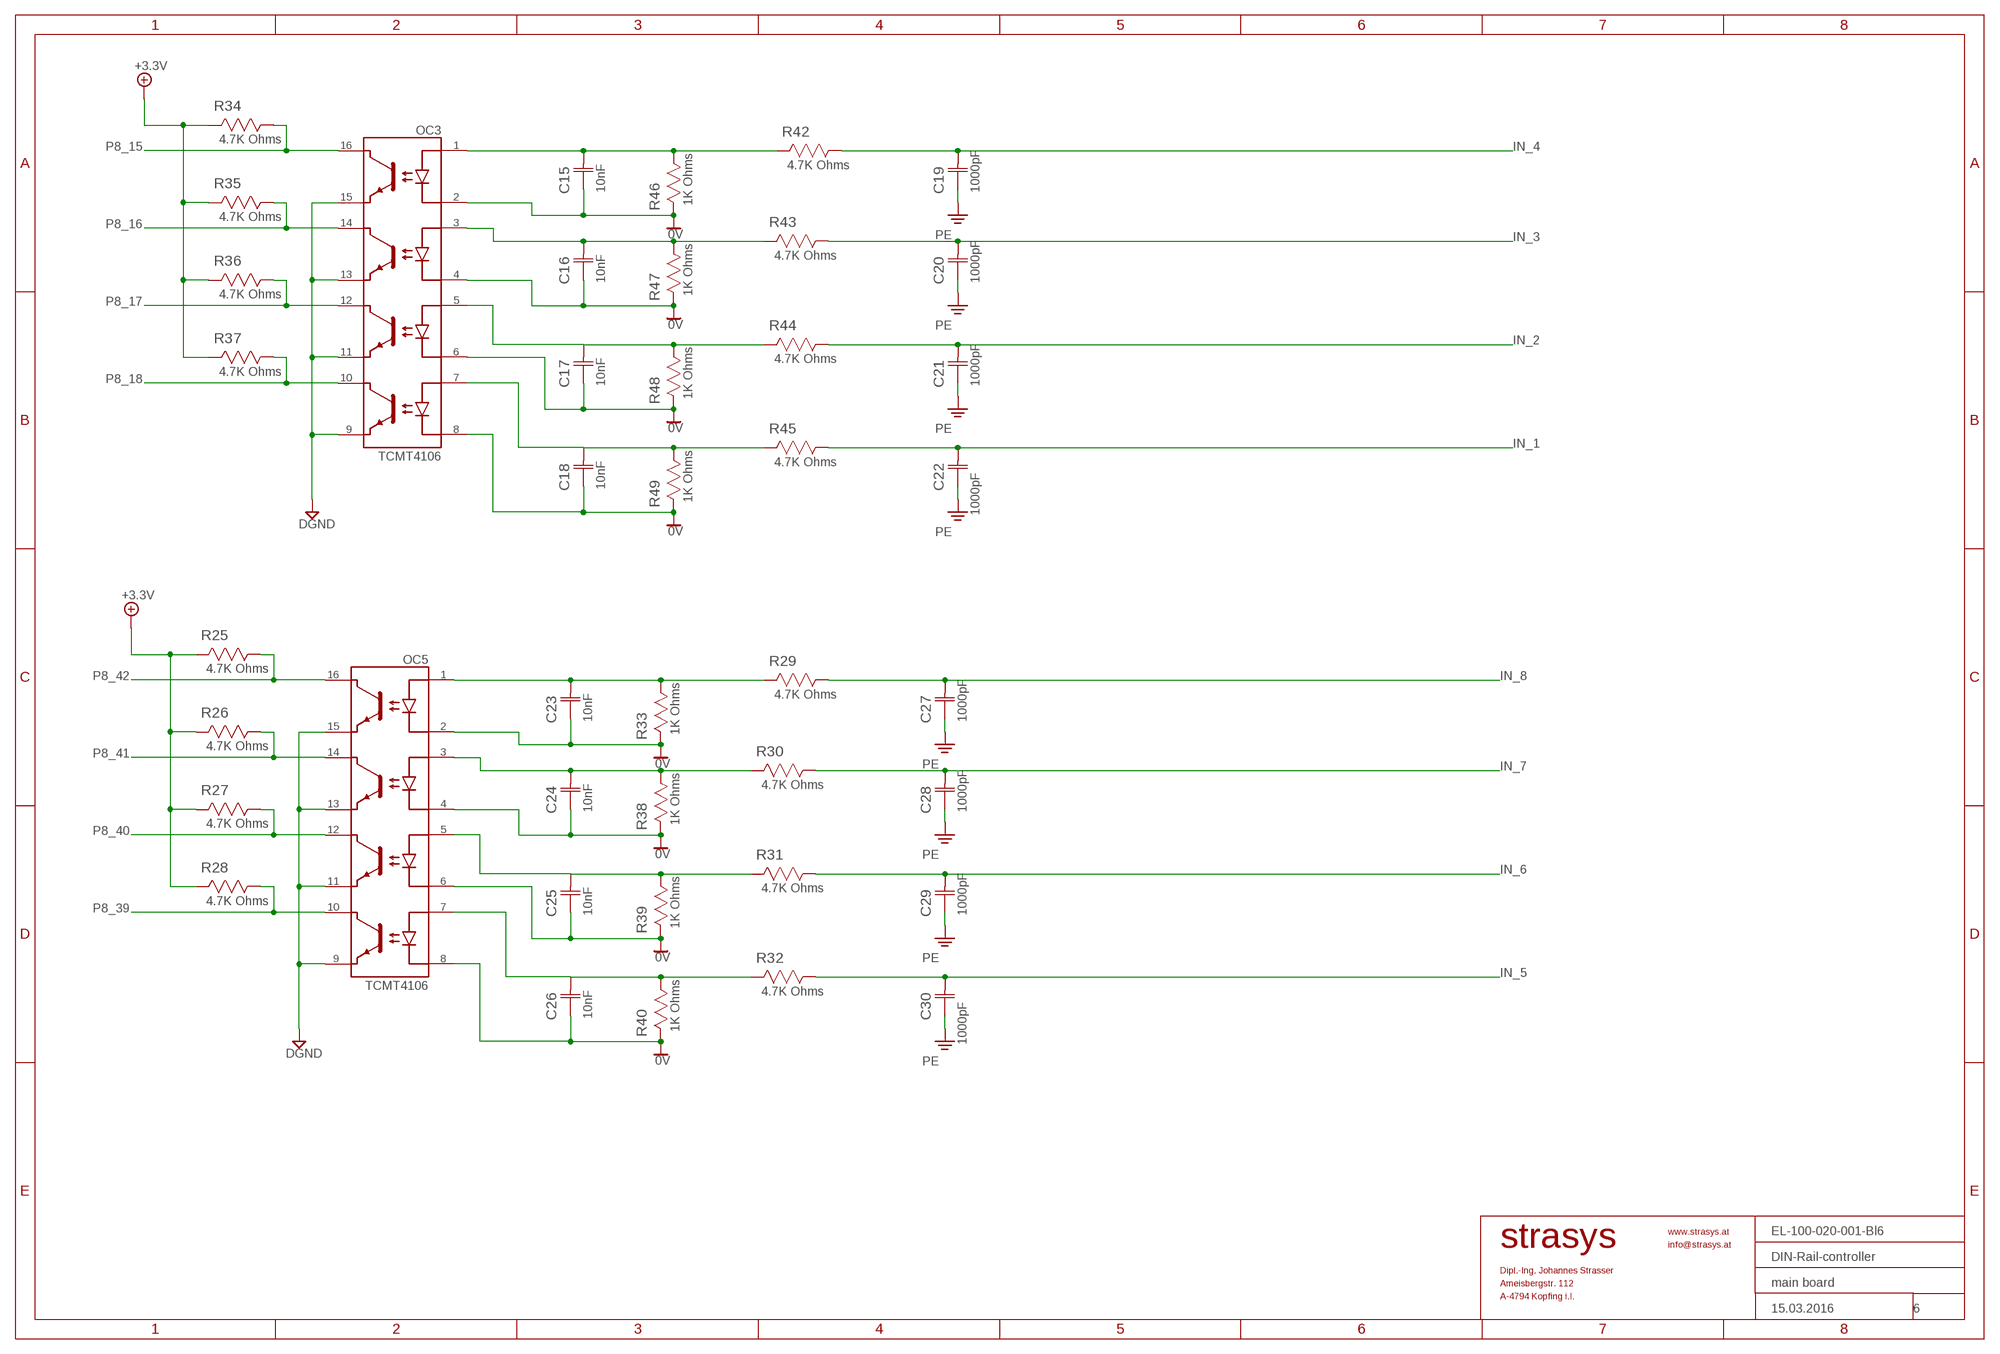
[diagram p5: schematic, sheet 6]
FRAME6 (A3L-LOC): DATE_DRAWING: 15.03.2016; DRAWING_NAME1: DIN-Rail-controller; DRAWING_NAME2: main board; DRAWING_NO: EL-100-020-001-Bl6; PAGE: 6

### Parts
C15  10nF  C0805C103K1RACTU  [CAPC2013X88N]
C16  10nF  C0805C103K1RACTU  [CAPC2013X88N]
C17  10nF  C0805C103K1RACTU  [CAPC2013X88N]
C18  10nF  C0805C103K1RACTU  [CAPC2013X88N]
C19  1000pF  C1206C102KDRACTU  [CAPC3216X88N]
C20  1000pF  C1206C102KDRACTU  [CAPC3216X88N]
C21  1000pF  C1206C102KDRACTU  [CAPC3216X88N]
C22  1000pF  C1206C102KDRACTU  [CAPC3216X88N]
C23  10nF  C0805C103K1RACTU  [CAPC2013X88N]
C24  10nF  C0805C103K1RACTU  [CAPC2013X88N]
C25  10nF  C0805C103K1RACTU  [CAPC2013X88N]
C26  10nF  C0805C103K1RACTU  [CAPC2013X88N]
C27  1000pF  C1206C102KDRACTU  [CAPC3216X88N]
C28  1000pF  C1206C102KDRACTU  [CAPC3216X88N]
C29  1000pF  C1206C102KDRACTU  [CAPC3216X88N]
C30  1000pF  C1206C102KDRACTU  [CAPC3216X88N]
OC3  TCMT4106  [SOP-16]
OC5  TCMT4106  [SOP-16]
R25  4.7K Ohms  CRCW08054K70JNEB  [RESC2013X65N]
R26  4.7K Ohms  CRCW08054K70JNEB  [RESC2013X65N]
R27  4.7K Ohms  CRCW08054K70JNEB  [RESC2013X65N]
R28  4.7K Ohms  CRCW08054K70JNEB  [RESC2013X65N]
R29  4.7K Ohms  CRCW08054K70JNEB  [RESC2013X65N]
R30  4.7K Ohms  CRCW08054K70JNEB  [RESC2013X65N]
R31  4.7K Ohms  CRCW08054K70JNEB  [RESC2013X65N]
R32  4.7K Ohms  CRCW08054K70JNEB  [RESC2013X65N]
R33  1K Ohms  CRCW08051K00JNEA  [RESC2013X65N]
R34  4.7K Ohms  CRCW08054K70JNEB  [RESC2013X65N]
R35  4.7K Ohms  CRCW08054K70JNEB  [RESC2013X65N]
R36  4.7K Ohms  CRCW08054K70JNEB  [RESC2013X65N]
R37  4.7K Ohms  CRCW08054K70JNEB  [RESC2013X65N]
R38  1K Ohms  CRCW08051K00JNEA  [RESC2013X65N]
R39  1K Ohms  CRCW08051K00JNEA  [RESC2013X65N]
R40  1K Ohms  CRCW08051K00JNEA  [RESC2013X65N]
R42  4.7K Ohms  CRCW08054K70JNEB  [RESC2013X65N]
R43  4.7K Ohms  CRCW08054K70JNEB  [RESC2013X65N]
R44  4.7K Ohms  CRCW08054K70JNEB  [RESC2013X65N]
R45  4.7K Ohms  CRCW08054K70JNEB  [RESC2013X65N]
R46  1K Ohms  CRCW08051K00JNEA  [RESC2013X65N]
R47  1K Ohms  CRCW08051K00JNEA  [RESC2013X65N]
R48  1K Ohms  CRCW08051K00JNEA  [RESC2013X65N]
R49  1K Ohms  CRCW08051K00JNEA  [RESC2013X65N]

### Nets
0V: C15.1(C1) C16.1(C1) C17.1(C1) C18.1(C1) C23.1(C1) C24.1(C1) C25.1(C1) C26.1(C1) OC3.2 OC3.4 OC3.6 OC3.8 OC5.2 OC5.4 OC5.6 OC5.8 R33.2 R38.2 R39.2 R40.2 R46.2 R47.2 R48.2 R49.2 ; also sheet 1,4,5,7,9
+3.3V: R25.2 R26.2 R27.2 R28.2 R34.2 R35.2 R36.2 R37.2 ; also sheet 2,3,7,8
DGND: OC3.9 OC3.11 OC3.13 OC3.15 OC5.9 OC5.11 OC5.13 OC5.15 ; also sheet 1,2,3,4,5,7,8,9
IN_1: C22.2(C2) R45.1 ; also sheet 1
IN_2: C21.2(C2) R44.1 ; also sheet 1
IN_3: C20.2(C2) R43.1 ; also sheet 1
IN_4: C19.2(C2) R42.1 ; also sheet 1
IN_5: C30.2(C2) R32.1 ; also sheet 1
IN_6: C29.2(C2) R31.1 ; also sheet 1
IN_7: C28.2(C2) R30.1 ; also sheet 1
IN_8: C27.2(C2) R29.1 ; also sheet 1
N$26: C23.2(C2) OC5.1 R29.2 R33.1
N$31: C24.2(C2) OC5.3 R30.2 R38.1
N$32: C25.2(C2) OC5.5 R31.2 R39.1
N$33: C26.2(C2) OC5.7 R32.2 R40.1
N$34: C15.2(C2) OC3.1 R42.2 R46.1
N$36: C16.2(C2) OC3.3 R43.2 R47.1
N$42: C17.2(C2) OC3.5 R44.2 R48.1
N$49: C18.2(C2) OC3.7 R45.2 R49.1
P8_15: OC3.16 R34.1 ; also sheet 2
P8_16: OC3.14 R35.1 ; also sheet 2
P8_17: OC3.12 R36.1 ; also sheet 2
P8_18: OC3.10 R37.1 ; also sheet 2
P8_39: OC5.10 R28.1 ; also sheet 2
P8_40: OC5.12 R27.1 ; also sheet 2
P8_41: OC5.14 R26.1 ; also sheet 2
P8_42: OC5.16 R25.1 ; also sheet 2
PE: C19.1(C1) C20.1(C1) C21.1(C1) C22.1(C1) C27.1(C1) C28.1(C1) C29.1(C1) C30.1(C1) ; also sheet 1,4,7,8

## Sheet 7 of 9
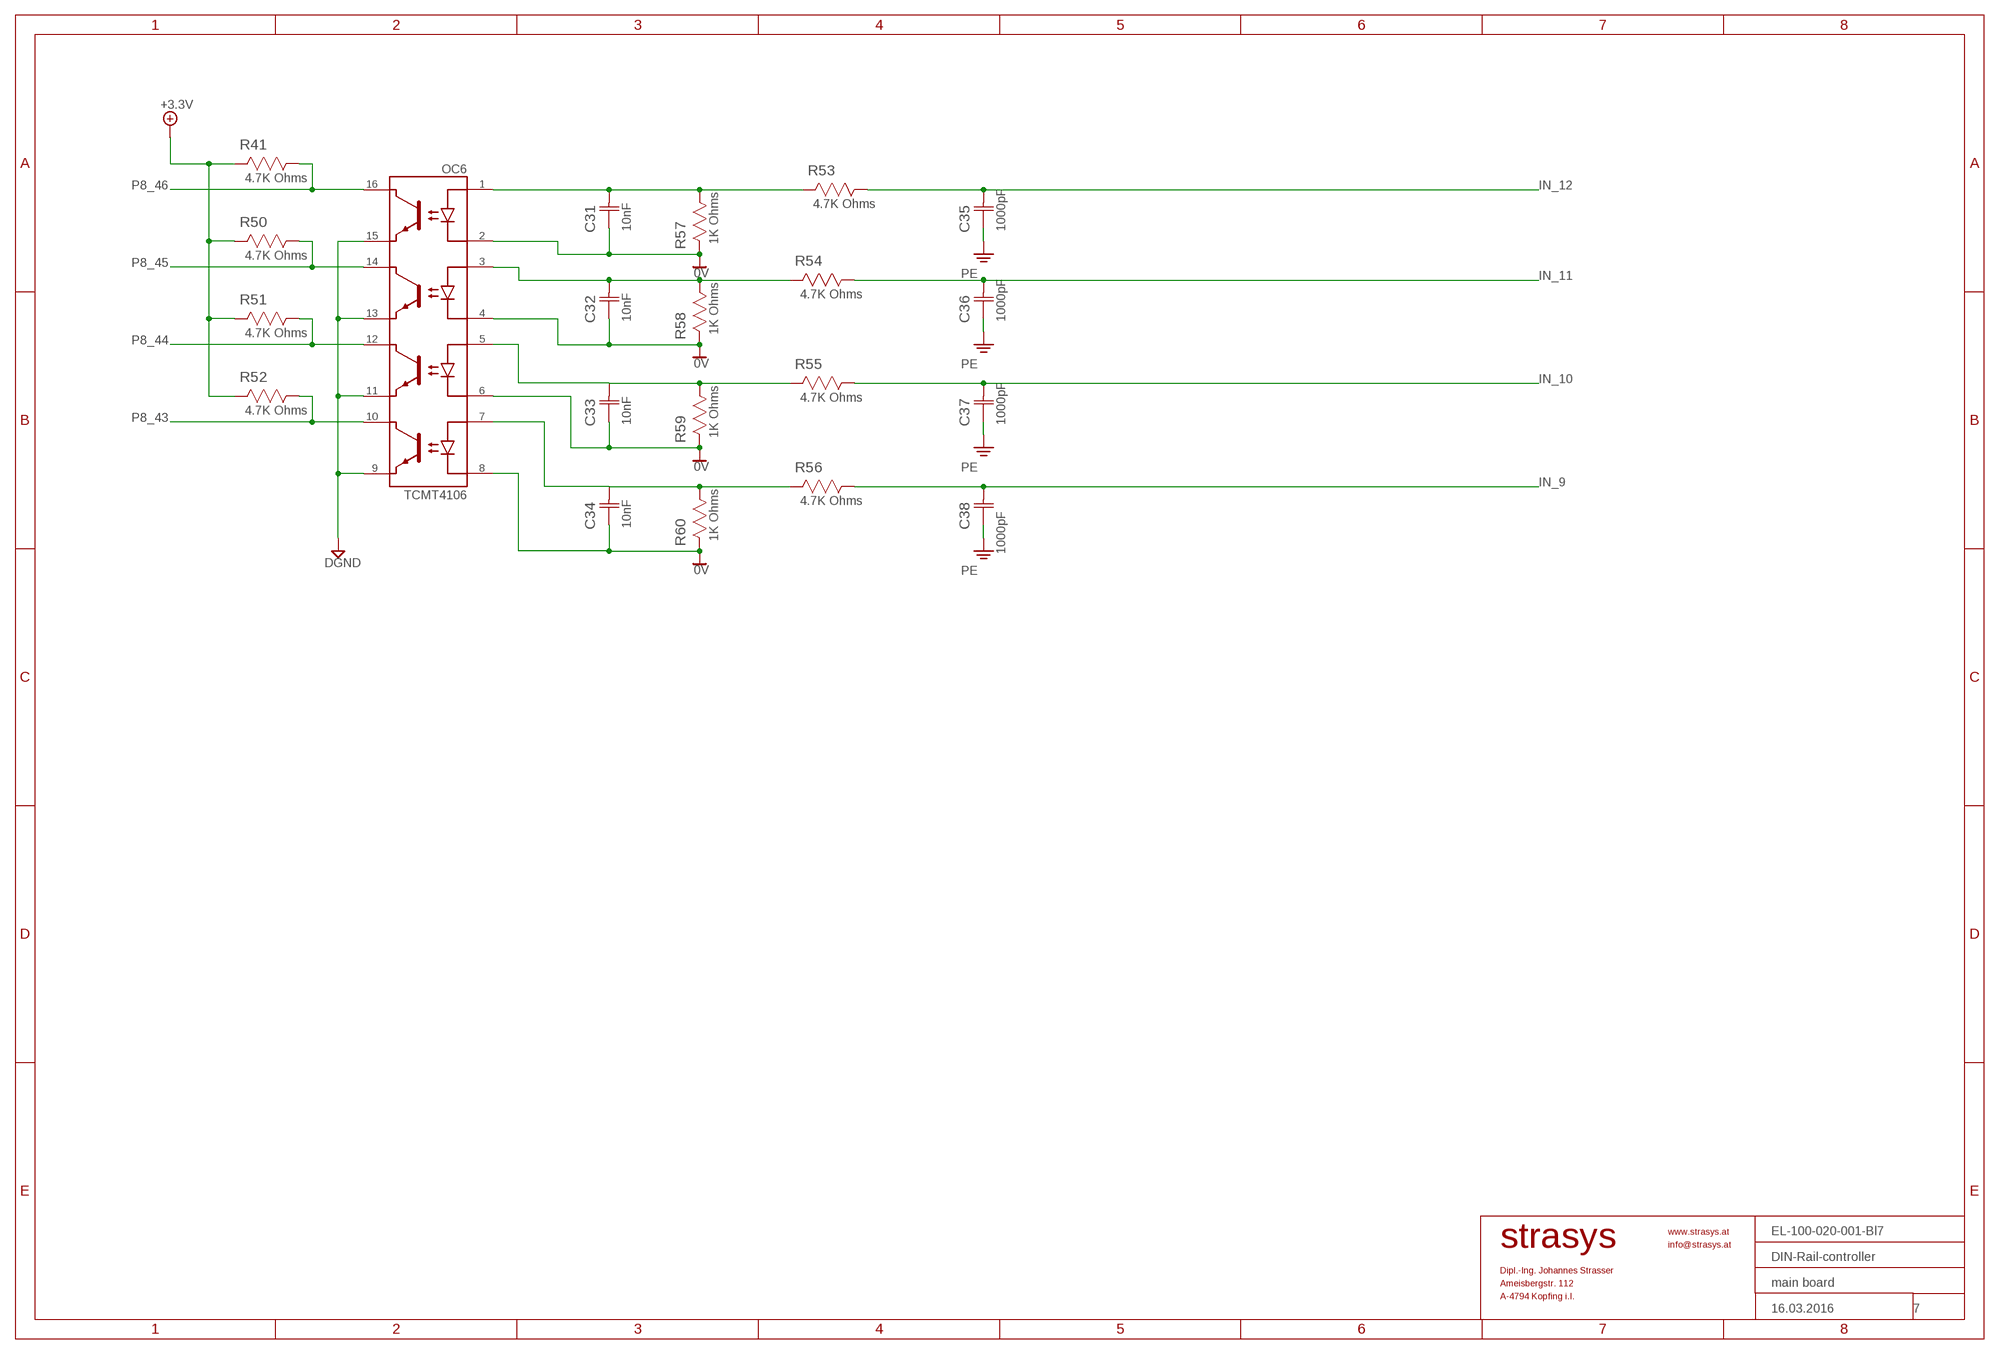
[diagram p6: schematic, sheet 7]
FRAME7 (A3L-LOC): DATE_DRAWING: 16.03.2016; DRAWING_NAME1: DIN-Rail-controller; DRAWING_NAME2: main board; DRAWING_NO: EL-100-020-001-Bl7; PAGE: 7

### Parts
C31  10nF  C0805C103K1RACTU  [CAPC2013X88N]
C32  10nF  C0805C103K1RACTU  [CAPC2013X88N]
C33  10nF  C0805C103K1RACTU  [CAPC2013X88N]
C34  10nF  C0805C103K1RACTU  [CAPC2013X88N]
C35  1000pF  C1206C102KDRACTU  [CAPC3216X88N]
C36  1000pF  C1206C102KDRACTU  [CAPC3216X88N]
C37  1000pF  C1206C102KDRACTU  [CAPC3216X88N]
C38  1000pF  C1206C102KDRACTU  [CAPC3216X88N]
OC6  TCMT4106  [SOP-16]
R41  4.7K Ohms  CRCW08054K70JNEB  [RESC2013X65N]
R50  4.7K Ohms  CRCW08054K70JNEB  [RESC2013X65N]
R51  4.7K Ohms  CRCW08054K70JNEB  [RESC2013X65N]
R52  4.7K Ohms  CRCW08054K70JNEB  [RESC2013X65N]
R53  4.7K Ohms  CRCW08054K70JNEB  [RESC2013X65N]
R54  4.7K Ohms  CRCW08054K70JNEB  [RESC2013X65N]
R55  4.7K Ohms  CRCW08054K70JNEB  [RESC2013X65N]
R56  4.7K Ohms  CRCW08054K70JNEB  [RESC2013X65N]
R57  1K Ohms  CRCW08051K00JNEA  [RESC2013X65N]
R58  1K Ohms  CRCW08051K00JNEA  [RESC2013X65N]
R59  1K Ohms  CRCW08051K00JNEA  [RESC2013X65N]
R60  1K Ohms  CRCW08051K00JNEA  [RESC2013X65N]

### Nets
0V: C31.1(C1) C32.1(C1) C33.1(C1) C34.1(C1) OC6.2 OC6.4 OC6.6 OC6.8 R57.2 R58.2 R59.2 R60.2 ; also sheet 1,4,5,6,9
+3.3V: R41.2 R50.2 R51.2 R52.2 ; also sheet 2,3,6,8
DGND: OC6.9 OC6.11 OC6.13 OC6.15 ; also sheet 1,2,3,4,5,6,8,9
IN_9: C38.2(C2) R56.1 ; also sheet 1
IN_10: C37.2(C2) R55.1 ; also sheet 1
IN_11: C36.2(C2) R54.1 ; also sheet 1
IN_12: C35.2(C2) R53.1 ; also sheet 1
N$35: C31.2(C2) OC6.1 R53.2 R57.1
N$37: C32.2(C2) OC6.3 R54.2 R58.1
N$38: C33.2(C2) OC6.5 R55.2 R59.1
N$39: C34.2(C2) OC6.7 R56.2 R60.1
P8_43: OC6.10 R52.1 ; also sheet 2
P8_44: OC6.12 R51.1 ; also sheet 2
P8_45: OC6.14 R50.1 ; also sheet 2
P8_46: OC6.16 R41.1 ; also sheet 2
PE: C35.1(C1) C36.1(C1) C37.1(C1) C38.1(C1) ; also sheet 1,4,6,8

## Sheet 8 of 9
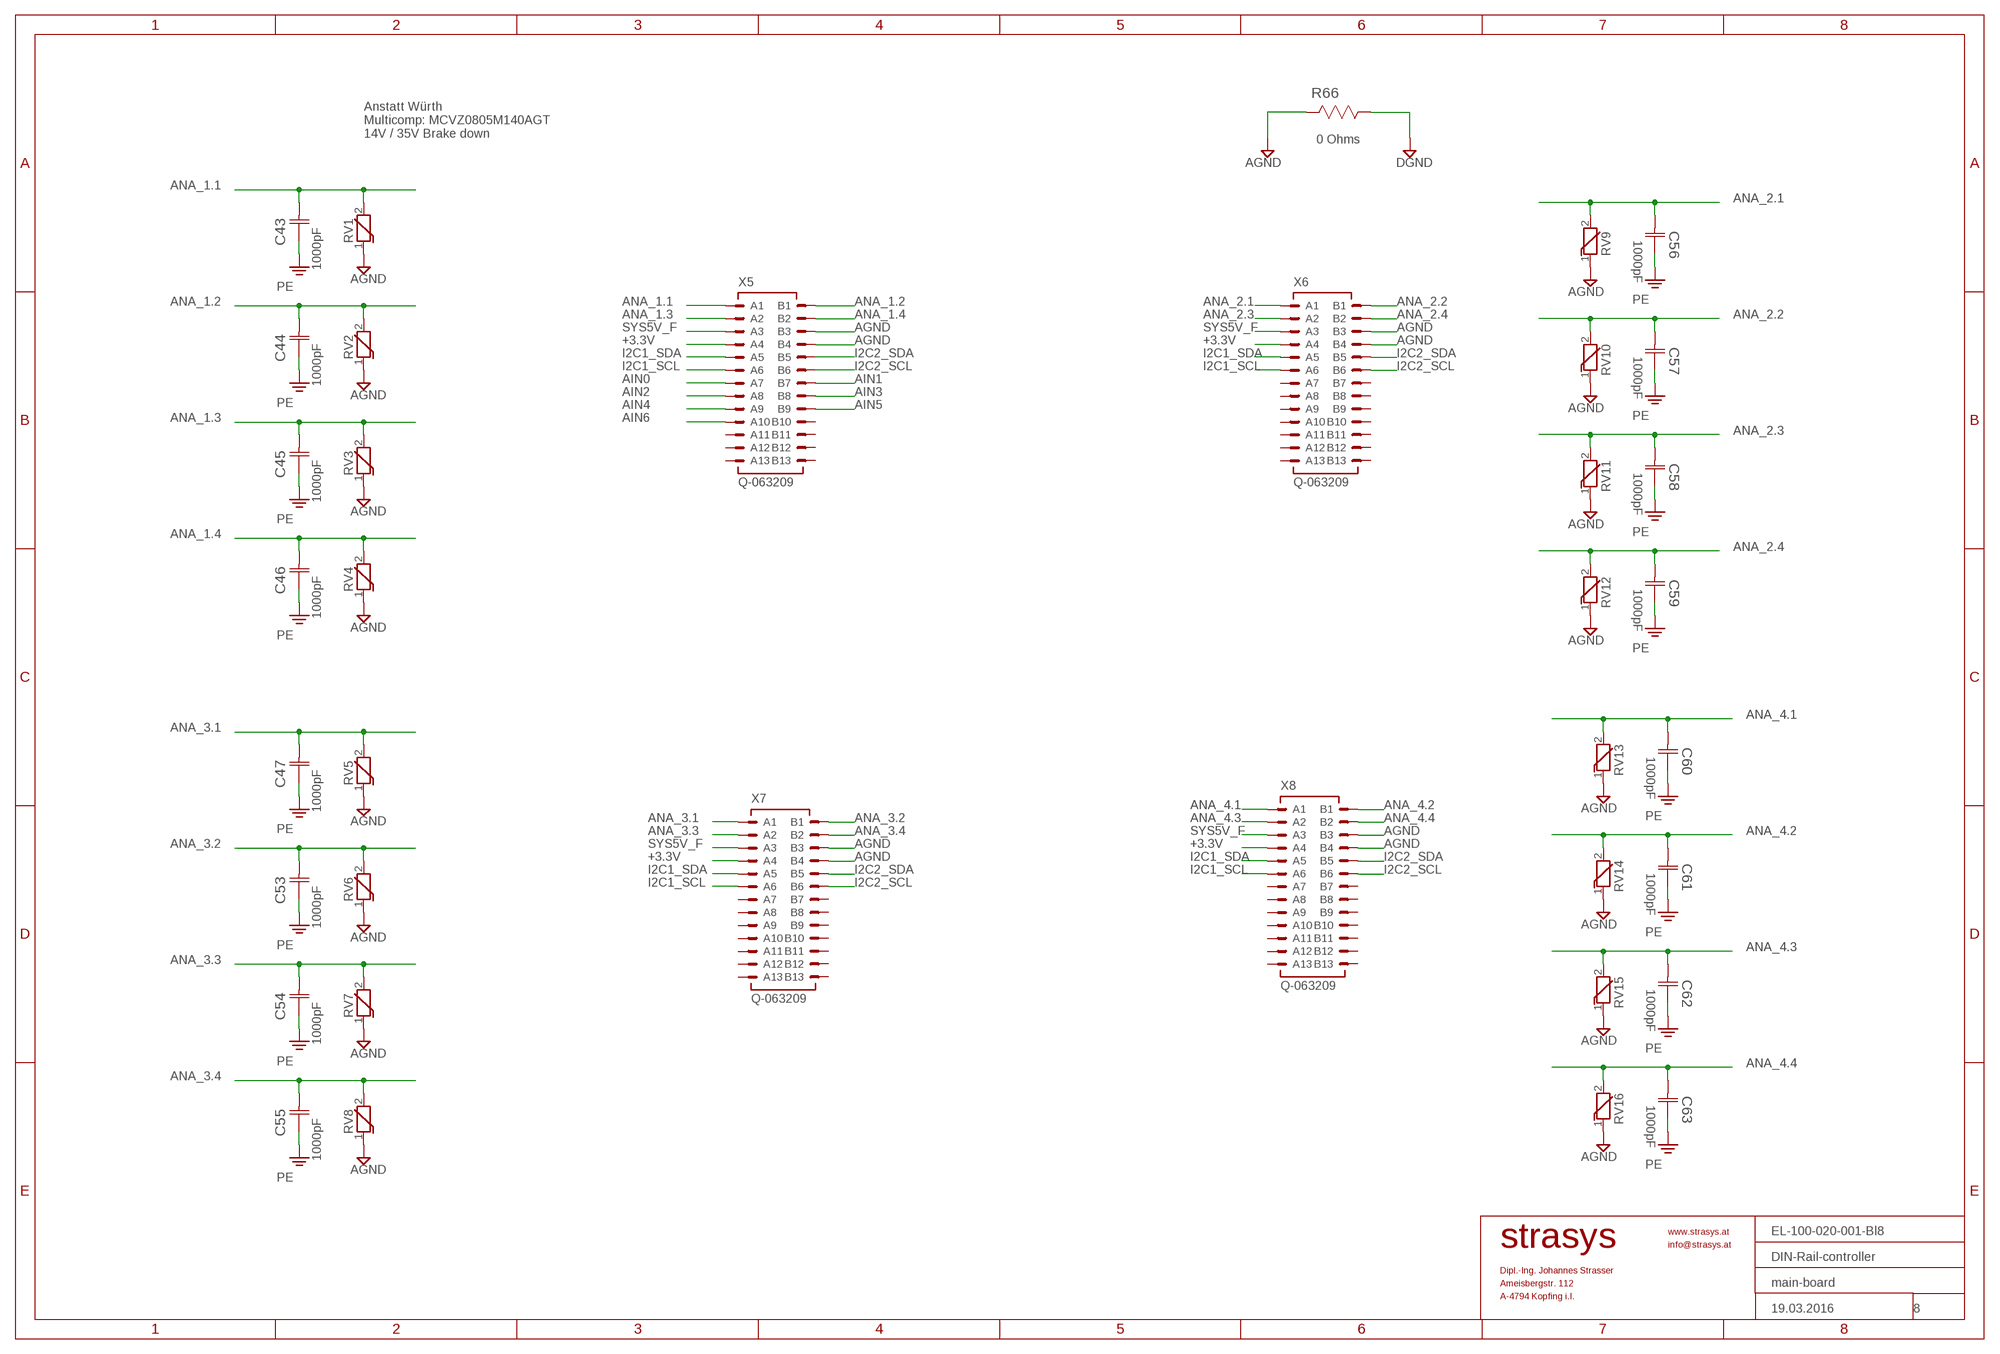
[diagram p7: schematic, sheet 8]
FRAME8 (A3L-LOC): DATE_DRAWING: 19.03.2016; DRAWING_NAME1: DIN-Rail-controller; DRAWING_NAME2: main-board; DRAWING_NO: EL-100-020-001-Bl8; PAGE: 8

### Parts
C43  1000pF  C1206C102KDRACTU  [CAPC3216X88N]
C44  1000pF  C1206C102KDRACTU  [CAPC3216X88N]
C45  1000pF  C1206C102KDRACTU  [CAPC3216X88N]
C46  1000pF  C1206C102KDRACTU  [CAPC3216X88N]
C47  1000pF  C1206C102KDRACTU  [CAPC3216X88N]
C53  1000pF  C1206C102KDRACTU  [CAPC3216X88N]
C54  1000pF  C1206C102KDRACTU  [CAPC3216X88N]
C55  1000pF  C1206C102KDRACTU  [CAPC3216X88N]
C56  1000pF  C1206C102KDRACTU  [CAPC3216X88N]
C57  1000pF  C1206C102KDRACTU  [CAPC3216X88N]
C58  1000pF  C1206C102KDRACTU  [CAPC3216X88N]
C59  1000pF  C1206C102KDRACTU  [CAPC3216X88N]
C60  1000pF  C1206C102KDRACTU  [CAPC3216X88N]
C61  1000pF  C1206C102KDRACTU  [CAPC3216X88N]
C62  1000pF  C1206C102KDRACTU  [CAPC3216X88N]
C63  1000pF  C1206C102KDRACTU  [CAPC3216X88N]
R66  0 Ohms  CRCW12060000Z0EA  [RESC3216X71N]
RV1  WE-VS-82550110_0805  [WESURGE_0805]
RV2  WE-VS-82550110_0805  [WESURGE_0805]
RV3  WE-VS-82550110_0805  [WESURGE_0805]
RV4  WE-VS-82550110_0805  [WESURGE_0805]
RV5  WE-VS-82550110_0805  [WESURGE_0805]
RV6  WE-VS-82550110_0805  [WESURGE_0805]
RV7  WE-VS-82550110_0805  [WESURGE_0805]
RV8  WE-VS-82550110_0805  [WESURGE_0805]
RV9  WE-VS-82550110_0805  [WESURGE_0805]
RV10  WE-VS-82550110_0805  [WESURGE_0805]
RV11  WE-VS-82550110_0805  [WESURGE_0805]
RV12  WE-VS-82550110_0805  [WESURGE_0805]
RV13  WE-VS-82550110_0805  [WESURGE_0805]
RV14  WE-VS-82550110_0805  [WESURGE_0805]
RV15  WE-VS-82550110_0805  [WESURGE_0805]
RV16  WE-VS-82550110_0805  [WESURGE_0805]
X5  Q-063209  [063209]
X6  Q-063209  [063209]
X7  Q-063209  [063209]
X8  Q-063209  [063209]

### Nets
+3.3V: X5.A4 X6.A4 X7.A4 X8.A4 ; also sheet 2,3,6,7
AGND: R66.2 RV1.1 RV2.1 RV3.1 RV4.1 RV5.1 RV6.1 RV7.1 RV8.1 RV9.1 RV10.1 RV11.1 RV12.1 RV13.1 RV14.1 RV15.1 RV16.1 X5.B3 X5.B4 X6.B3 X6.B4 X7.B3 X7.B4 X8.B3 X8.B4 ; also sheet 1,2
AIN0: X5.A7 ; also sheet 2
AIN1: X5.B7 ; also sheet 2
AIN2: X5.A8 ; also sheet 2
AIN3: X5.B8 ; also sheet 2
AIN4: X5.A9 ; also sheet 2
AIN5: X5.B9 ; also sheet 2
AIN6: X5.A10 ; also sheet 2
ANA_1.1: C43.2(C2) RV1.2 X5.A1 ; also sheet 1
ANA_1.2: C44.2(C2) RV2.2 X5.B1 ; also sheet 1
ANA_1.3: C45.2(C2) RV3.2 X5.A2 ; also sheet 1
ANA_1.4: C46.2(C2) RV4.2 X5.B2 ; also sheet 1
ANA_2.1: C56.2(C2) RV9.2 X6.A1 ; also sheet 1
ANA_2.2: C57.2(C2) RV10.2 X6.B1 ; also sheet 1
ANA_2.3: C58.2(C2) RV11.2 X6.A2 ; also sheet 1
ANA_2.4: C59.2(C2) RV12.2 X6.B2 ; also sheet 1
ANA_3.1: C47.2(C2) RV5.2 X7.A1 ; also sheet 1
ANA_3.2: C53.2(C2) RV6.2 X7.B1 ; also sheet 1
ANA_3.3: C54.2(C2) RV7.2 X7.A2 ; also sheet 1
ANA_3.4: C55.2(C2) RV8.2 X7.B2 ; also sheet 1
ANA_4.1: C60.2(C2) RV13.2 X8.A1 ; also sheet 1
ANA_4.2: C61.2(C2) RV14.2 X8.B1 ; also sheet 1
ANA_4.3: C62.2(C2) RV15.2 X8.A2 ; also sheet 1
ANA_4.4: C63.2(C2) RV16.2 X8.B2 ; also sheet 1
DGND: R66.1 ; also sheet 1,2,3,4,5,6,7,9
I2C1_SCL: X5.A6 X6.A6 X7.A6 X8.A6 ; also sheet 2,3
I2C1_SDA: X5.A5 X6.A5 X7.A5 X8.A5 ; also sheet 2,3
I2C2_SCL: X5.B6 X6.B6 X7.B6 X8.B6 ; also sheet 2,3
I2C2_SDA: X5.B5 X6.B5 X7.B5 X8.B5 ; also sheet 2,3
PE: C43.1(C1) C44.1(C1) C45.1(C1) C46.1(C1) C47.1(C1) C53.1(C1) C54.1(C1) C55.1(C1) C56.1(C1) C57.1(C1) C58.1(C1) C59.1(C1) C60.1(C1) C61.1(C1) C62.1(C1) C63.1(C1) ; also sheet 1,4,6,7
SYS5V_F: X5.A3 X6.A3 X7.A3 X8.A3 ; also sheet 2,9
Unconnected: X5.A11 X5.A12 X5.A13 X5.B10 X5.B11 X5.B12 X5.B13 X6.A7 X6.A8 X6.A9 X6.A10 X6.A11 X6.A12 X6.A13 X6.B7 X6.B8 X6.B9 X6.B10 X6.B11 X6.B12 X6.B13 X7.A7 X7.A8 X7.A9 X7.A10 X7.A11 X7.A12 X7.A13 X7.B7 X7.B8 X7.B9 X7.B10 X7.B11 X7.B12 X7.B13 X8.A7 X8.A8 X8.A9 X8.A10 X8.A11 X8.A12 X8.A13 X8.B7 X8.B8 X8.B9 X8.B10 X8.B11 X8.B12 X8.B13

### Notes on the sheet
- Anstatt Würth 
  Multicomp: MCVZ0805M140AGT
  14V / 35V Brake down

## Sheet 9 of 9
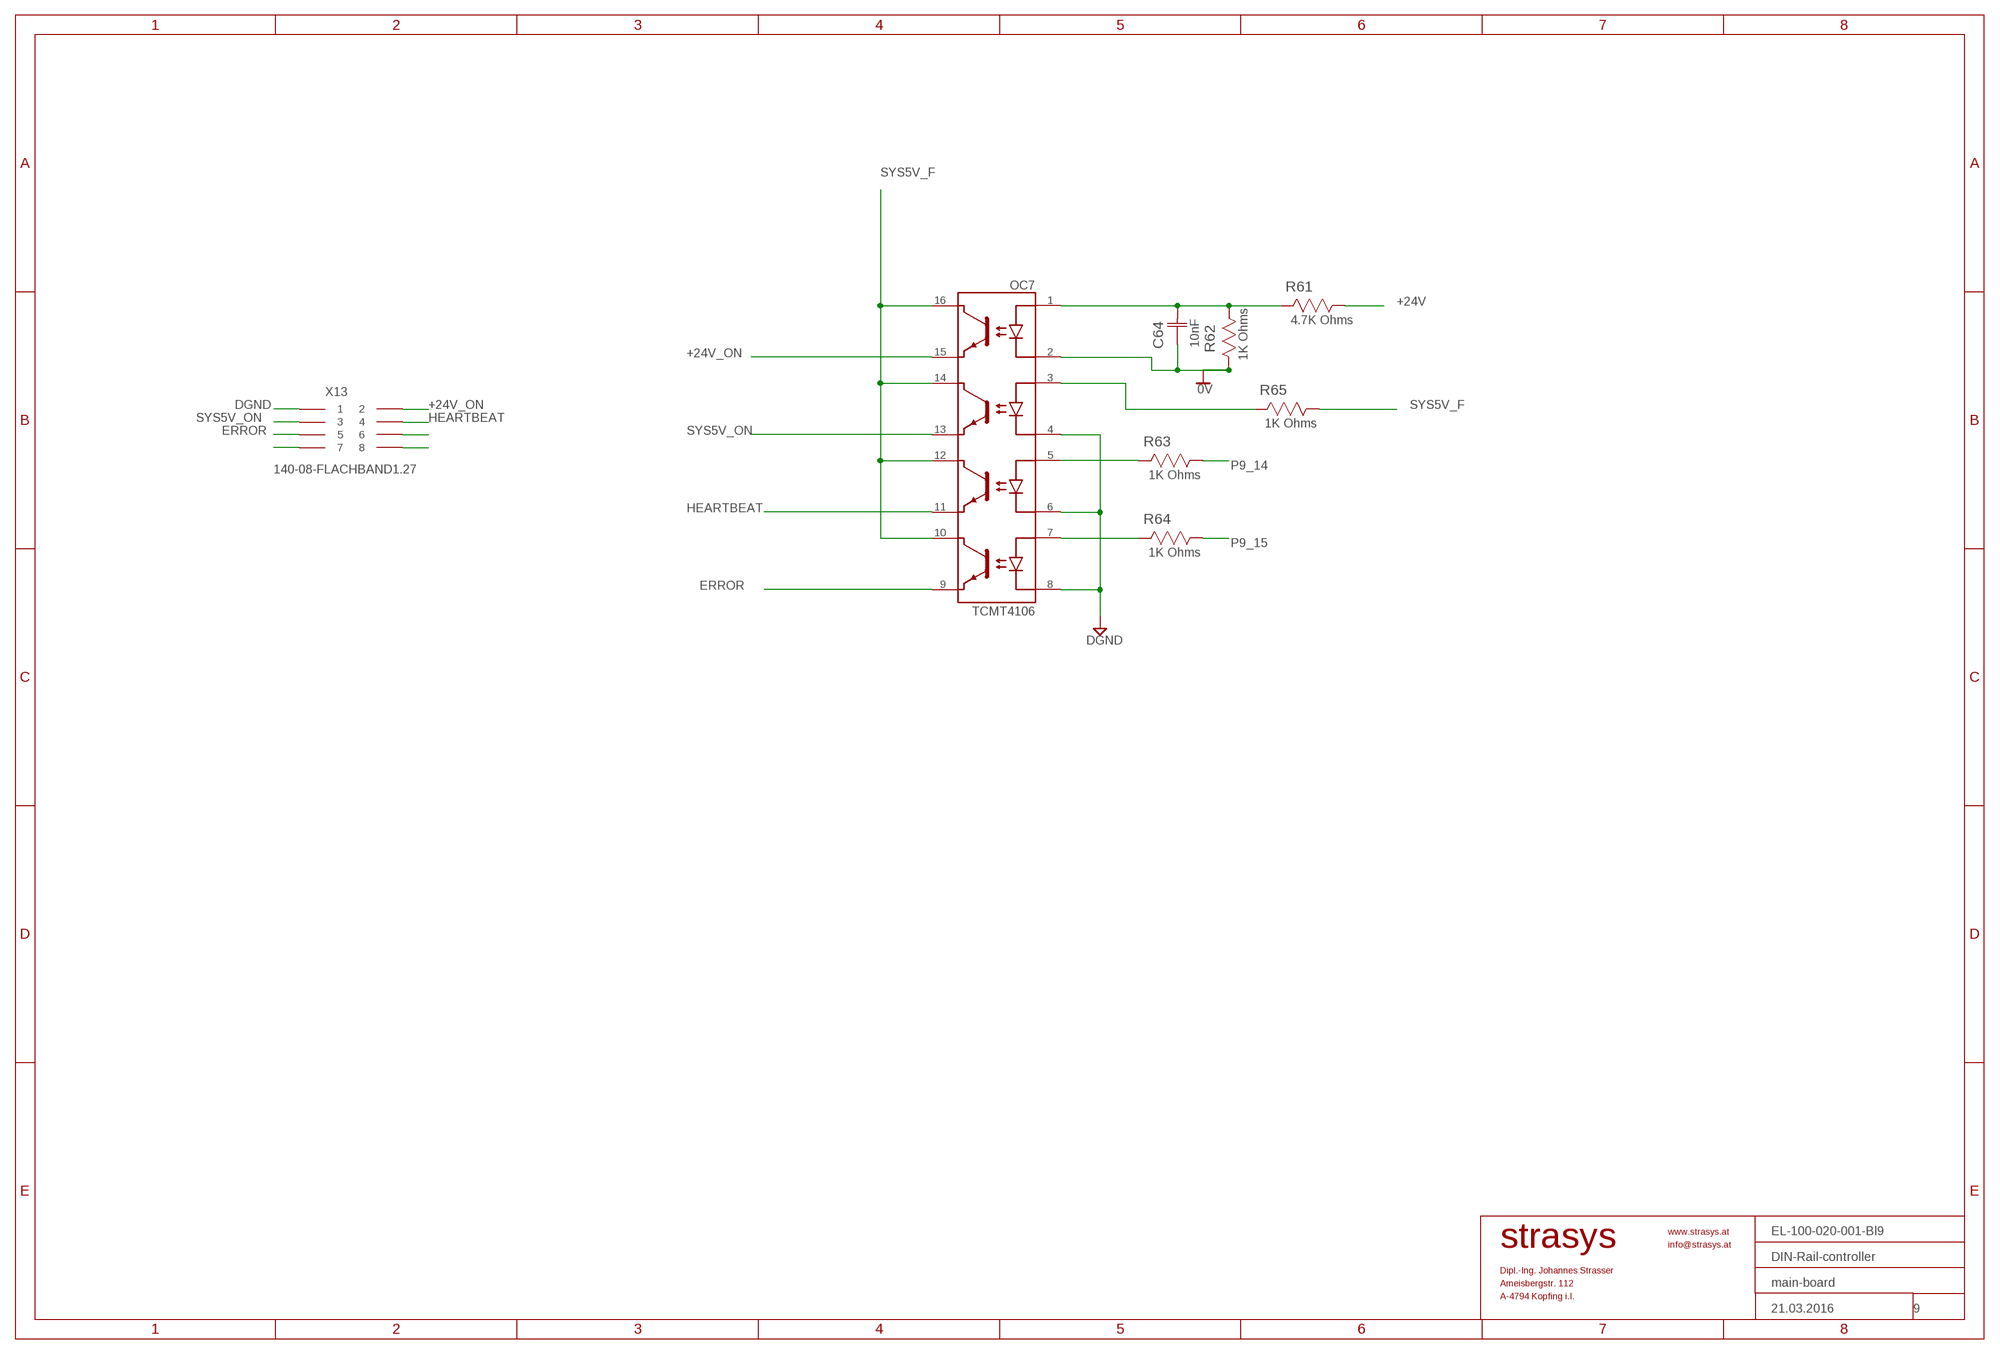
[diagram p8: schematic, sheet 9]
FRAME9 (A3L-LOC): DATE_DRAWING: 21.03.2016; DRAWING_NAME1: DIN-Rail-controller; DRAWING_NAME2: main-board; DRAWING_NO: EL-100-020-001-Bl9; PAGE: 9

### Parts
C64  10nF  C0805C103K1RACTU  [CAPC2013X88N]
OC7  TCMT4106  [SOP-16]
R61  4.7K Ohms  CRCW08054K70JNEB  [RESC2013X65N]
R62  1K Ohms  CRCW08051K00JNEA  [RESC2013X65N]
R63  1K Ohms  CRCW08051K00JNEA  [RESC2013X65N]
R64  1K Ohms  CRCW08051K00JNEA  [RESC2013X65N]
R65  1K Ohms  CRCW08051K00JNEA  [RESC2013X65N]
X13  140-08-FLACHBAND1.27  [2,54_2X8]

### Nets
0V: C64.1(C1) OC7.2 R62.2 ; also sheet 1,4,5,6,7
+24V: R61.1 ; also sheet 1,4,5
+24V_ON: OC7.15 X13.P2
DGND: OC7.4 OC7.6 OC7.8 X13.P1 ; also sheet 1,2,3,4,5,6,7,8
ERROR: OC7.9 X13.P5
HEARTBEAT: OC7.11 X13.P4
N$40: C64.2(C2) OC7.1 R61.2 R62.1
N$41: OC7.5 R63.2
N$43: OC7.7 R64.2
N$52: X13.P7
N$54: X13.P6
N$55: X13.P8
P9_14: R63.1 ; also sheet 2
P9_15: R64.1 ; also sheet 2
SYS5V_F: OC7.3 OC7.10 OC7.12 OC7.14 OC7.16 R65.1 R65.2 ; also sheet 2,8
SYS5V_ON: OC7.13 X13.P3

## Library data of the parts
BAT1 = strasys_standard:BATTERY_COIN_CLIP: Battery Coin Holder 16mm For 16 mm battery coins; MF: KEYSTONE; MPN: 3013; OC_FARNELL: 1650698; PACKAGE: 16mm; SUPPLIER: Keystone
C1 = Kemet_By_element14_1:C1206C225K5RACTU: CAPACITOR, 1206; MPN: C1206C225K5RACTU; OC_FARNELL: 1288208; OC_NEWARK: 88K0223; SUPPLIER: Kemet; TOLERANCE: ±10%; VOLTAGERATING: 50V
C2 C48 C49 = Kemet_By_element14_1:C0805C104K5RACTU: CAPACITOR, 0805; MF: KEMET; MPN: C0805C104K5RACTU; OC_FARNELL: 1414664; OC_NEWARK: 65H7431; SUPPLIER: Kemet; TOLERANCE: ±10%; VOLTAGERATING: 50V
C3-C18 C23-C26 C31-C34 C64 = Kemet_By_element14_1:C0805C103K1RACTU: CAPACITOR, 0805; MF: KEMET; MPN: C0805C103K1RACTU; OC_FARNELL: 1414661; OC_NEWARK: 99B3817; SUPPLIER: Kemet; TOLERANCE: ±10%; VOLTAGERATING: 100V
C19-C22 C27-C30 C35-C38 C43-C47 C53-C63 = supply2:C1206C102KDRACTU: Capacitor 1206; MF: KEMET; MPN: C1206C102KDRACTU; OC_FARNELL: 1826304; SUPPLIER: Kemet; TOLERANCE: +/- 10%; VOLTAGE_RATING: 1000V
C39 C40 = Kemet_By_element14_1:C0805F472K1RACAUTO: CAPACITOR, 0805; MPN: C0805F472K1RACAUTO; OC_FARNELL: 1869057; OC_NEWARK: 32T6750; SUPPLIER: KEMET; TOLERANCE: ±10%; VALUE: 4700pF; VOLTAGERATING: 100V
C41 = strasys_standard:EEE-: Aluminum Electrolytic Capacitors,Surface Mount Type; MPN: EEE-FK1C470P; OC_FARNELL: 1850100; OC_NEWARK: 23T0848; PACKAGE: CASE-D; SUPPLIER: PANASONIC; TOLERANCE: ±20 %; VOLTAGERATING: 16V
C42 = Kemet_By_element14_1:C0805C104K5RACTU: CAPACITOR, 0805; MPN: C0805C104K5RACTU; OC_FARNELL: 1414664; OC_NEWARK: 65H7431; SUPPLIER: Kemet; TOLERANCE: ±10%; VOLTAGERATING: 50V
C50 = Kemet_By_element14_1:C0805C120J5GACTU: CAPACITOR, 0805; MF: KEMET; MPN: C0805C120J5GACTU; OC_FARNELL: 1414666; OC_NEWARK: 64K2898; SUPPLIER: Kemet; TOLERANCE: ±5%; VOLTAGERATING: 50V
C51 = Kemet_By_element14_1:C0805C100J5GACTU: CAPACITOR, 0805; MF: KEMET; MPN: C0805C100J5GACTU; OC_FARNELL: 1414654; OC_NEWARK: 64K2873; SUPPLIER: Kemet; TOLERANCE: ±5%; VOLTAGERATING: 50V
C52 = Kemet_By_element14_1:C0805C101J5GACTU: CAPACITOR, 0805; MF: KEMET; MPN: C0805C101J5GACTU; OC_FARNELL: 1414656; OC_NEWARK: 19C6007; SUPPLIER: Kemet; TOLERANCE: ±5%; VOLTAGERATING: 50V
D1 = strasys_standard:SMA6J: TVS - Diode SMA6J series bidirectional; MPN: SMA6J33CA-TR; OC_FARNELL: 1689245; PACKAGE: DO-214AC; SUPPLIER: ST-Microelectronics
L1 = WE-CBF:WE-CBF: SMD EMI Suppression Ferrite Beads WE-CBF - Excellent anti-EMI properties - Low DC-restistance - Impedances till 3000 ohms - Rated current up to 6 A -- Reliable Ni-Sn electrodes -- Perfect as data lined filter and for uncoupling of distribution voltage; MPN: 74279218; OC_FARNELL: 1635758; OC_NEWARK: 08P2403; PACKAGE: IND-1206; SUPPLIER: Wuerth Elektronik
OC1-OC7 = strasys_standard:TCMT4106: 4 - Kanal Optokoppler Gehäuse: SOT-16; MANUFACTURER: Vishay; MPN: TMCT4106; PACKAGE: SOT-16
PCB1 = e14_BeagleBoneBlack_RevA:BEAGLEBONE_BLACK_EXT: Device for a BeagleBone Black Rev. C without an associated package. Intended to allow the addition of a BBB in a schematic for the designer to show how wired connections are made to the BBB without having a footprint on the board. More information available at: www.element14.com/community/community/designcenter/single-board-computers/next-gen_beaglebone
R1-R9 R18-R20 R33 R38-R40 R46-R49 R57-R60 R62-R65 = Vishay_By_element14_Batch_1:CRCW08051K00JNEA: RESISTOR, 0805; MF: VISHAY DRALORIC; MPN: CRCW08051K00JNEA; OC_FARNELL: 1652937; OC_NEWARK: 52K9725; SUPPLIER: Vishay; TOLERANCE: ±5%; WATTAGE: 0.125 W
R10-R17 R21-R24 = Vishay_By_element14_Batch_1:CRCW080547K0JNEA: RESISTOR, 0805; MF: VISHAY DRALORIC; MPN: CRCW080547K0JNEA; OC_FARNELL: 1514867; OC_NEWARK: 59M6914; SUPPLIER: VISHAY DALE ELECTRONICS; TOLERANCE: ±5%; WATTAGE: 0.125 W
R25-R32 R34-R37 R41-R45 R50-R56 R61 = Vishay_By_element14_Batch_1:CRCW08054K70JNEB: RESISTOR, 0805; MF: VISHAY DRALORIC; MPN: CRCW08054K70JNEB; OC_FARNELL: 1872057; OC_NEWARK: 65J2003; SUPPLIER: Vishay Dale; TOLERANCE: ±5%; WATTAGE: 0.125W
R66 = Vishay_By_element14_Batch_1:CRCW12060000Z0EA: RESISTOR, 1206; MPN: CRCW12060000Z0EA; OC_FARNELL: 1469963; OC_NEWARK: 53K1778; SUPPLIER: Vishay; TOLERANCE: -; WATTAGE: 0.25W
R67-R70 R83 R84 = Vishay_By_element14_Batch_1:CRCW080510K0JNEA: RESISTOR, 0805; MF: VISHAY DRALORIC; MPN: CRCW080510K0JNEA; OC_FARNELL: 1469857; OC_NEWARK: 52K9797; SUPPLIER: Vishay; TOLERANCE: ±5%; WATTAGE: 0.125 W
R87 = Vishay_By_element14_Batch_1:CRCW08051K00FKEA: RESISTOR, 0805; MF: VISHAY DRALORIC; MPN: CRCW08051K00FKEA; OC_FARNELL: 1469847; OC_NEWARK: 52K9723; SUPPLIER: Vishay; TOLERANCE: ±1%; WATTAGE: 0.125 W
RV1-RV16 = WE-VS:WE-VS: WESURGE SMD Varistor WE-VS - Fast response time - Low leakage current - Low clamping voltage - Wide range of voltage avaible - Almost no energy consumption in stand-by mode - Excellent absorption at surge-impulses - Nickel barrier for leadfree soldering - Operating temperature: -40°C to +85°C for size 0402 to 0805; -40°C to +1255°C for size 1206 to 2220 -- Protection of DC distribution -- Protection of power supply -- Protection of semiconductors -- Protection of bus systems and communication lines -- Limiting of over-voltage -- ESD protection in accordance with EN 61000-4-2 and Surge protection in accordance with EN 61000-4-5; MPN: 82550110; OC_FARNELL: 1636441; OC_NEWARK: 08P3035; PACKAGE: 0805; SUPPLIER: WURTH ELEKTRONIK
T1 = strasys_standard:WS-TST-90°: Tact Switch Tact switch series WE-TST 90° type; MF: WURTH ELEKTRONIK; MPN: 431256038726; OC_FARNELL: 2065135; SUPPLIER: Wuerth Electronic
U1-U3 = strasys_standard:VNI4140K: Quad high-side smart power solid-state relay,power SSO-24; MF: STMICROELECTRONICS; MPN: VNI4140K-32; OC_FARNELL: 2309423; OC_MOUSER: 511-VNI4140KTR-32; PACKAGE: SO-24; SUPPLIER: STMICROELECTRONICS
U8 = Microchip-MCP7940N-I_SN:MCP7940N-I/SN: I2C™ Real-Time Clock/Calendar with SRAM,SOIC-8; MF: MICROCHIP; MPN: MCP7940N-I/SN; OC_FARNELL: 2361122; OC_NEWARK: 26T2748; PACKAGE: SOIC-8; SUPPLIER: MICROCHIP
U9 = strasys_standard:PMEG2005ET: 500 mA low VF single MEGA Schottky barrier rectifier; MF: NXP; MPN: PMEG2005ET; OC_FARNELL: 1510672; PACKAGE: SOT-23-3; SUPPLIER: NXP
U16 = Microchip_By_element14_Batch_1:24AA256-I/SN: EEPROM; MF: MICROCHIP; MPN: 24AA256-I/SN; OC_FARNELL: 1331295; OC_NEWARK: 92C6874; PACKAGE: SOIC-8; SUPPLIER: MICROCHIP
U19 = strasys_standard:ABS10: Crystal Frequency: 32.768 kHz Capacitance: 7pF; MF: ABRACON; MPN: ABS10-32.768KHZ-7-T; OC_FARNELL: 2101351; SUPPLIER: ABRACON
X1 X2 = strasys_standard:944-12-46-00: 2.54 mm 2 - reihiger male connector; MPN: 944-12-46-00; SUPPLIER: W+P
X3 X4 = strasys_standard:90G-14: Weidmüller Clamp Connector; MPN: SL 3.50/14/90G; SUPPLIER: Weidmüller
X5-X8 = con-erni:Q-063209: Male Connector SMC-Q 26 contacts Standard Assembly Height Source: http://www.erni.com/DB/PDF-Drawing/SMC/063209.pdf; OC_FARNELL: unknown; OC_NEWARK: unknown
X9-X12 = strasys_standard:S2L3.50/8/90G: OMNIMATE S2L3.50/8/90G Fa. Weidmüller; SUPPLIER: Weidmüller
X13 = strasys_standard:140-08-FLACHBAND1.27: IDC Leiterplattenverbinder RM 2,54 Flachbandkabel 1,27 mm
X14 = strasys_standard:944-12-2-00: Stiftleiste RM 2,54mm gerade 2 x 1

## Net classes
0 default: clearance 0.205 mm